# Altium project IMX93EVK-SOM.PrjPcb (part 4 of 6)

## Sheet C-12 PWR MEAS.SchDoc
size 817 x 513 mm; Address1: 350W 9th Ave; Address2: Suite 206; Address3: Escondido CA 92025; Address4: United States; Revision: -; ENG_APP_DATE: --/--/--; DSN_APP_DATE: --/--/--; CHK_APP_DATE: --/--/--
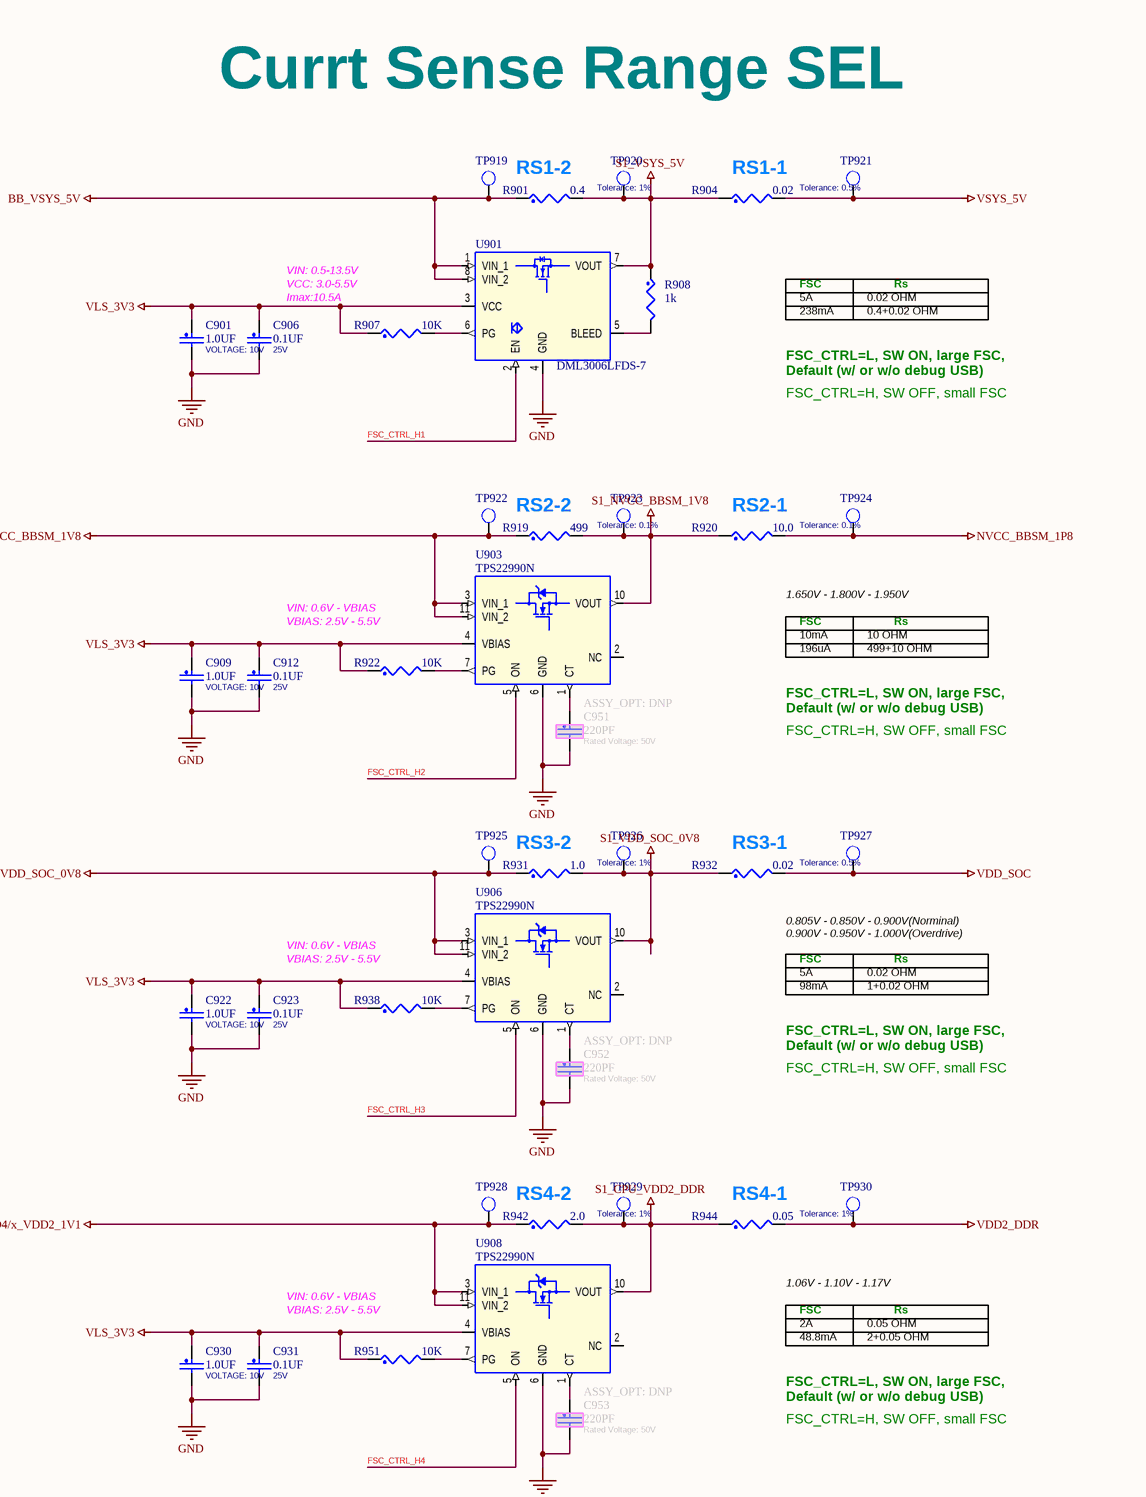
[diagram p22: C-12 PWR MEAS.SchDoc, top left]
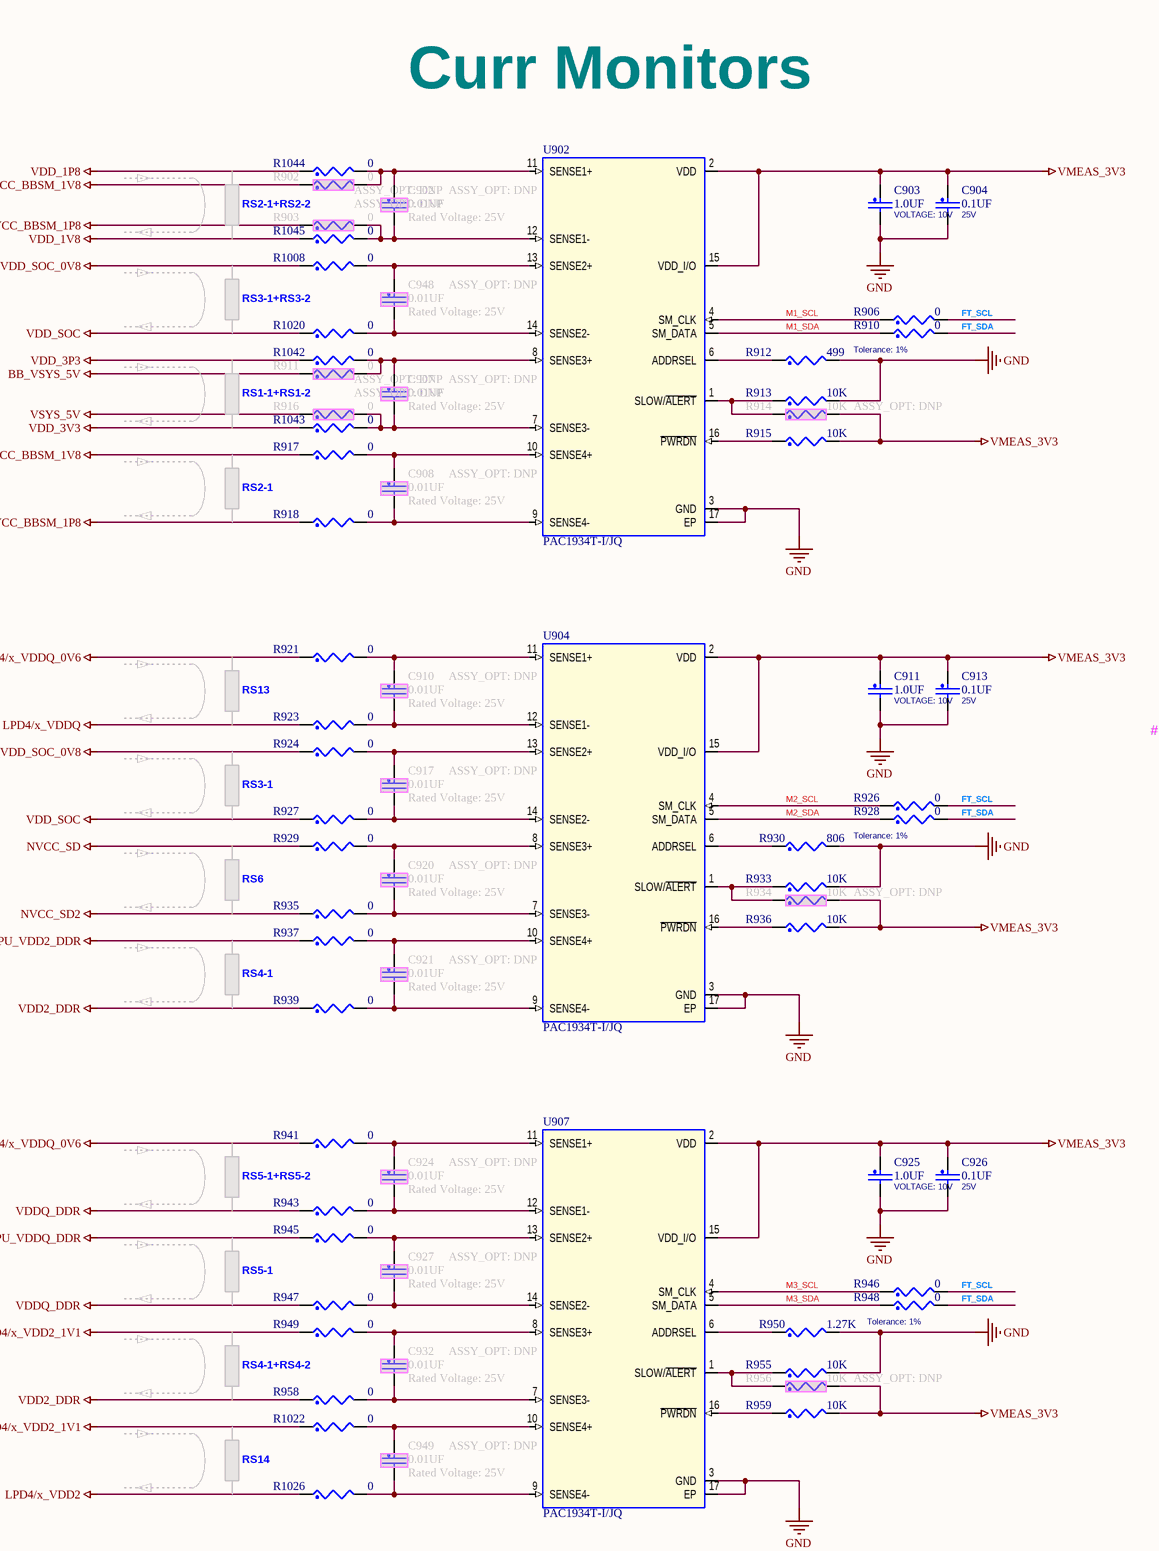
[diagram p23: C-12 PWR MEAS.SchDoc, top middle]
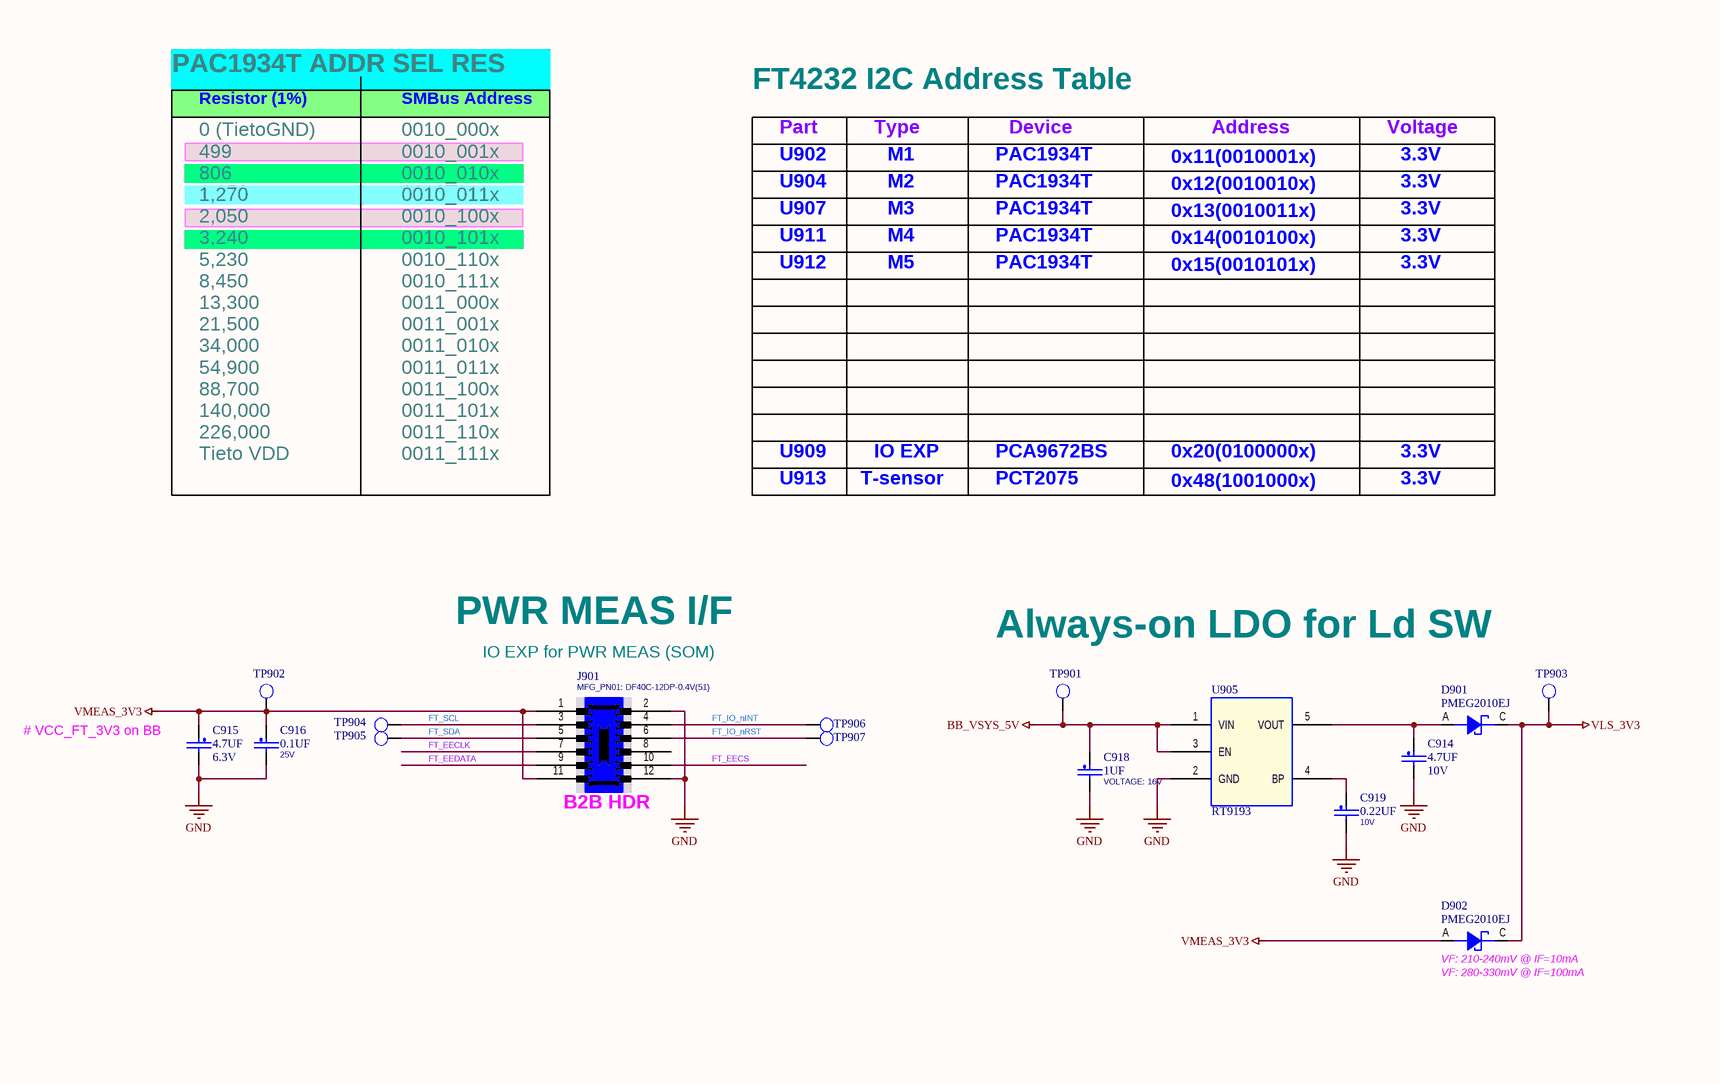
[diagram p24: C-12 PWR MEAS.SchDoc, top right]
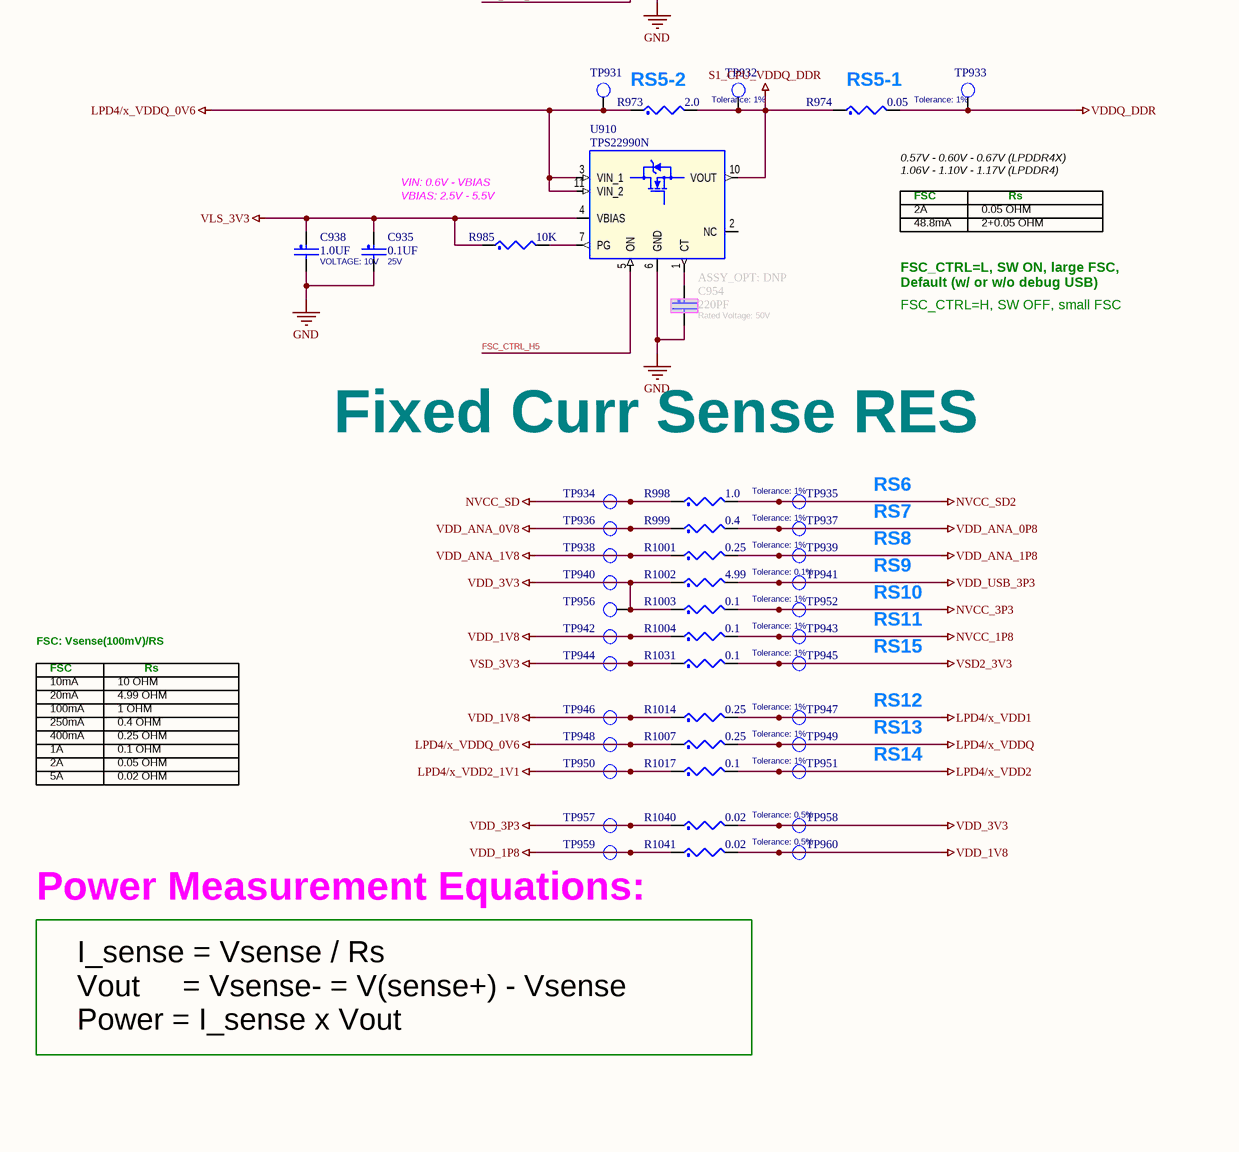
[diagram p25: C-12 PWR MEAS.SchDoc, bottom left]
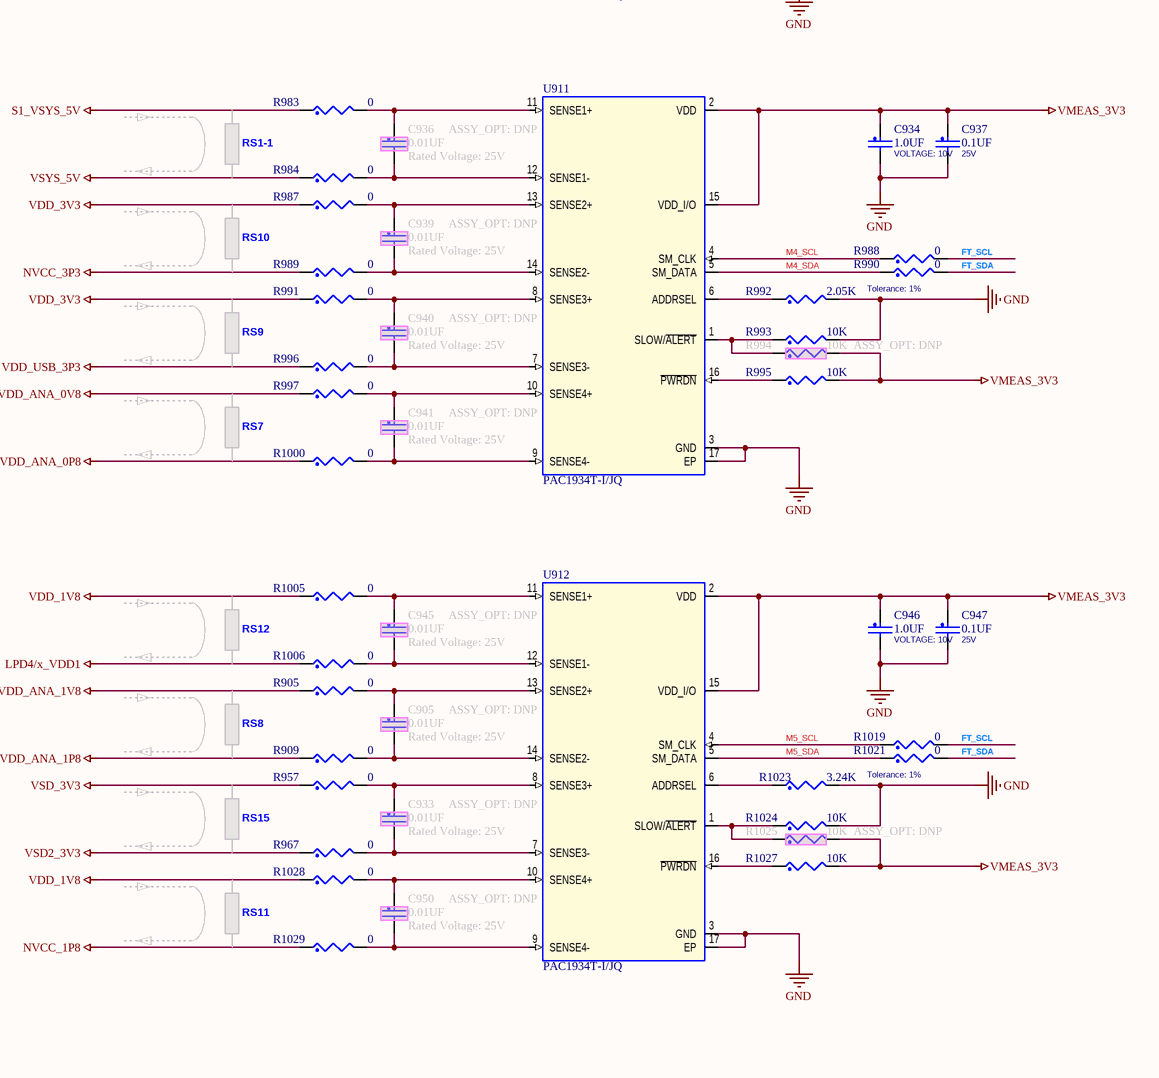
[diagram p26: C-12 PWR MEAS.SchDoc, bottom middle]
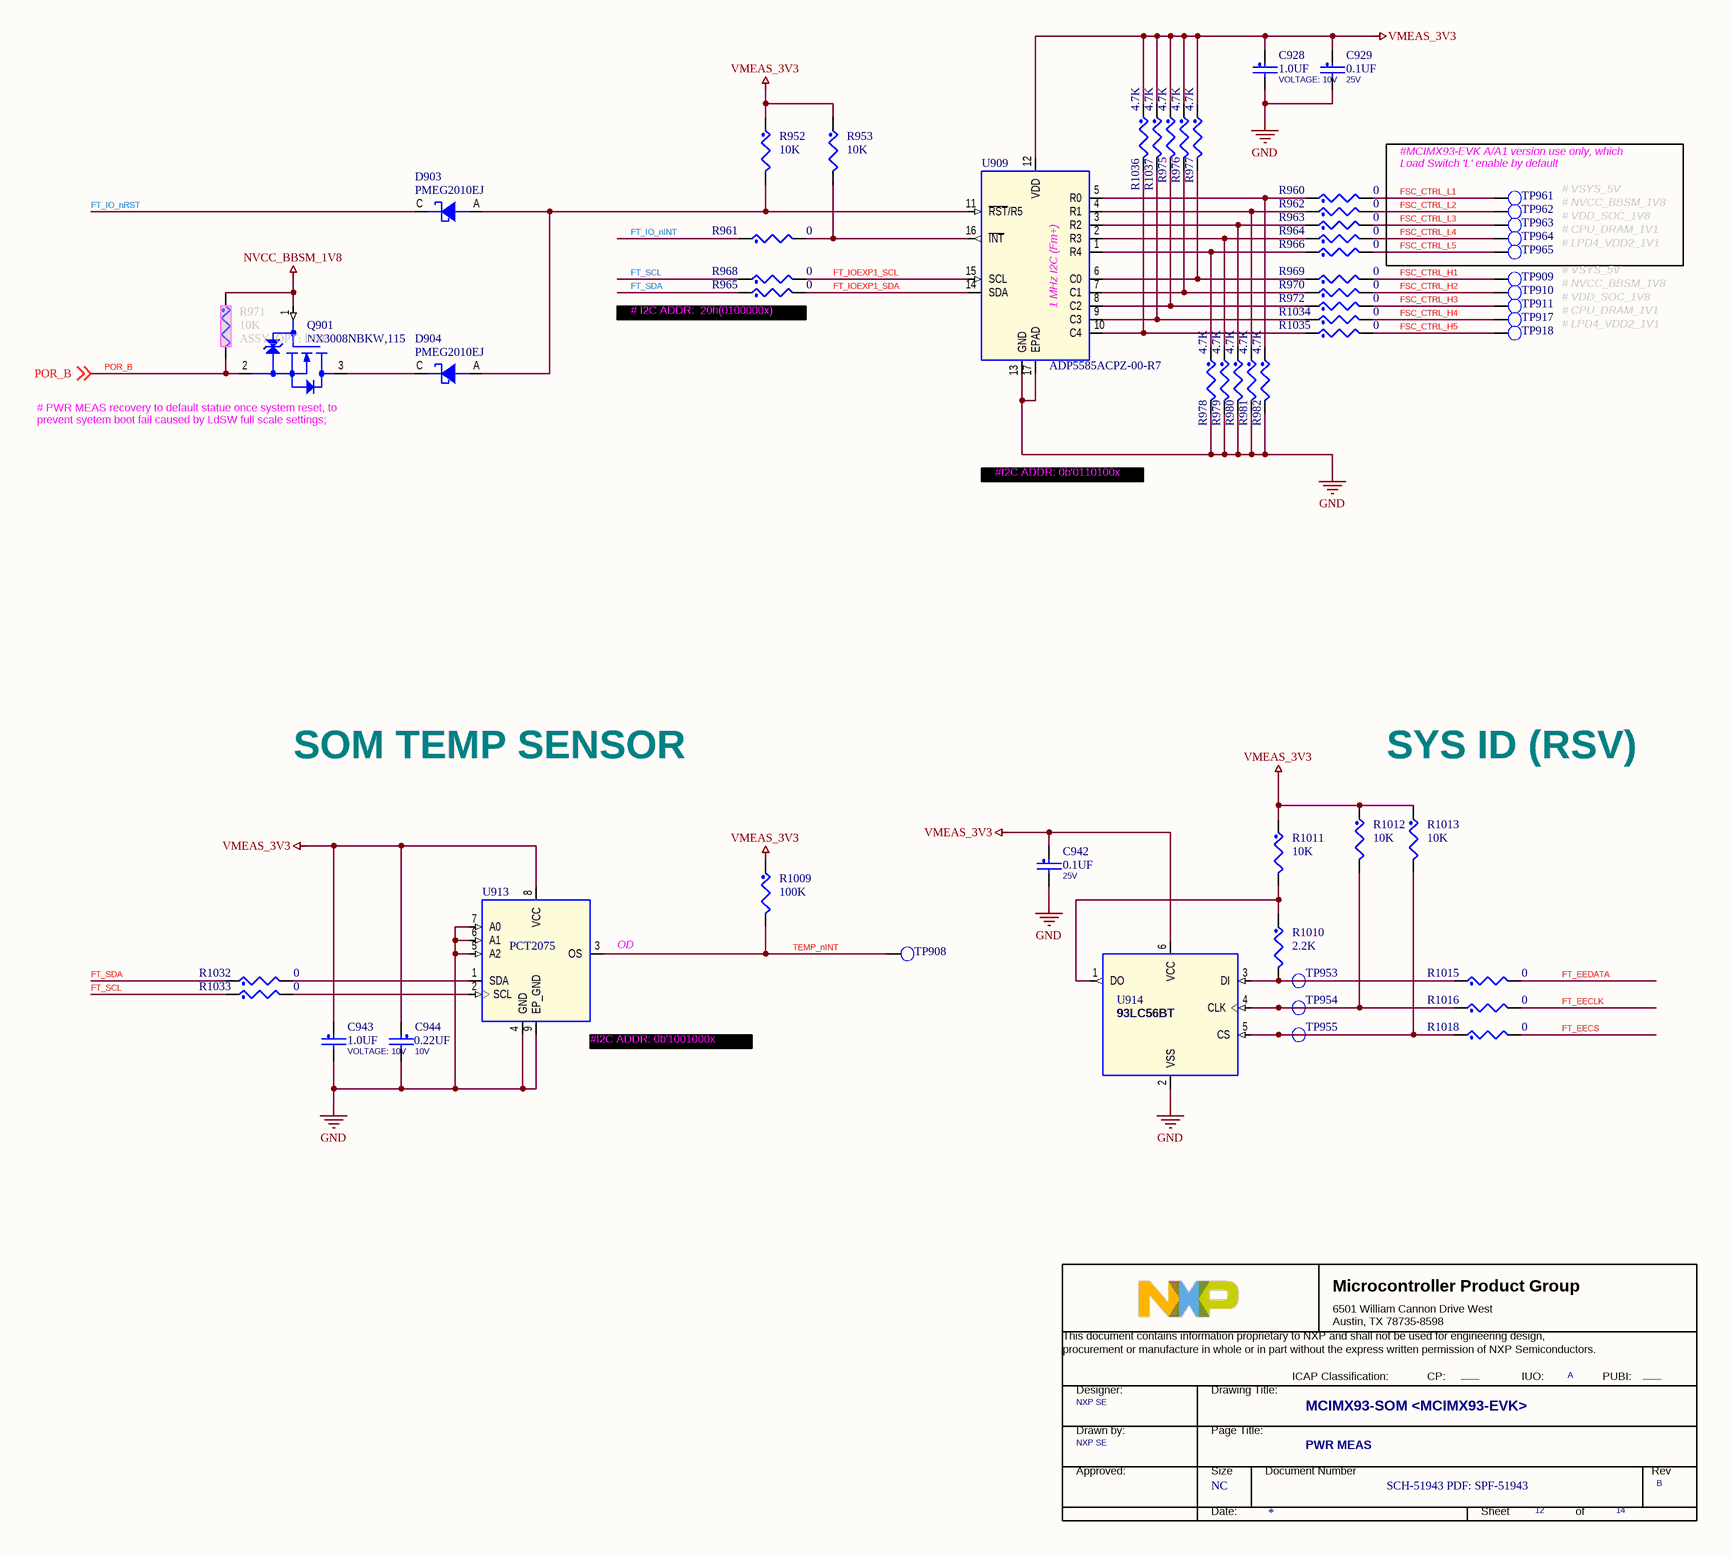
[diagram p27: C-12 PWR MEAS.SchDoc, bottom right]

### Parts
(Parts that share a designator on the sheet are numbered #1, #2 ... from top to bottom, then left to right.)
*#12  Doc: SCH-51943 PDF: SPF-51943  RevCode: B  Title: MCIMX93-SOM <MCIMX93-EVK>  Page Size: NC  Page Number: 12  Page Count: 14  PageTitle: PWR MEAS  Designer: NXP SE  PUBI: ____  FIUO: A  (hidden comment: TitleBlock_MCPG)  (graphical)
C901  1.0UF  VOLTAGE: 10V  [0402_CC]
C902  0.01UF  ASSY_OPT: DNP  Rated Voltage: 25V  [CC0402_25]
C903  1.0UF  VOLTAGE: 10V  [0402_CC]
C904  0.1UF  VOLTAGE: 25V  [0402_CC]
C905  0.01UF  ASSY_OPT: DNP  Rated Voltage: 25V  [CC0402_25]
C906  0.1UF  VOLTAGE: 25V  [0402_CC]
C907  0.01UF  ASSY_OPT: DNP  Rated Voltage: 25V  [CC0402_25]
C908  0.01UF  ASSY_OPT: DNP  Rated Voltage: 25V  [CC0402_25]
C909  1.0UF  VOLTAGE: 10V  [0402_CC]
C910  0.01UF  ASSY_OPT: DNP  Rated Voltage: 25V  [CC0402_25]
C911  1.0UF  VOLTAGE: 10V  [0402_CC]
C912  0.1UF  VOLTAGE: 25V  [0402_CC]
C913  0.1UF  VOLTAGE: 25V  [0402_CC]
C914  4.7UF  VOLTAGE: 10V  [cc0402_tol0p15]
C915  4.7UF  voltage rating: 6.3V  [cc0402_tol0p15]
C916  0.1UF  VOLTAGE: 25V  [0402_CC]
C917  0.01UF  ASSY_OPT: DNP  Rated Voltage: 25V  [CC0402_25]
C918  1UF  VOLTAGE: 16V  [0402_CC]
C919  0.22UF  VOLTAGE: 10V  [0201_CC]
C920  0.01UF  ASSY_OPT: DNP  Rated Voltage: 25V  [CC0402_25]
C921  0.01UF  ASSY_OPT: DNP  Rated Voltage: 25V  [CC0402_25]
C922  1.0UF  VOLTAGE: 10V  [0402_CC]
C923  0.1UF  VOLTAGE: 25V  [0402_CC]
C924  0.01UF  ASSY_OPT: DNP  Rated Voltage: 25V  [CC0402_25]
C925  1.0UF  VOLTAGE: 10V  [0402_CC]
C926  0.1UF  VOLTAGE: 25V  [0402_CC]
C927  0.01UF  ASSY_OPT: DNP  Rated Voltage: 25V  [CC0402_25]
C928  1.0UF  VOLTAGE: 10V  [0402_CC]
C929  0.1UF  VOLTAGE: 25V  [0402_CC]
C930  1.0UF  VOLTAGE: 10V  [0402_CC]
C931  0.1UF  VOLTAGE: 25V  [0402_CC]
C932  0.01UF  ASSY_OPT: DNP  Rated Voltage: 25V  [CC0402_25]
C933  0.01UF  ASSY_OPT: DNP  Rated Voltage: 25V  [CC0402_25]
C934  1.0UF  VOLTAGE: 10V  [0402_CC]
C935  0.1UF  VOLTAGE: 25V  [0402_CC]
C936  0.01UF  ASSY_OPT: DNP  Rated Voltage: 25V  [CC0402_25]
C937  0.1UF  VOLTAGE: 25V  [0402_CC]
C938  1.0UF  VOLTAGE: 10V  [0402_CC]
C939  0.01UF  ASSY_OPT: DNP  Rated Voltage: 25V  [CC0402_25]
C940  0.01UF  ASSY_OPT: DNP  Rated Voltage: 25V  [CC0402_25]
C941  0.01UF  ASSY_OPT: DNP  Rated Voltage: 25V  [CC0402_25]
C942  0.1UF  VOLTAGE: 25V  [0402_CC]
C943  1.0UF  VOLTAGE: 10V  [0402_CC]
C944  0.22UF  VOLTAGE: 10V  [0201_CC]
C945  0.01UF  ASSY_OPT: DNP  Rated Voltage: 25V  [CC0402_25]
C946  1.0UF  VOLTAGE: 10V  [0402_CC]
C947  0.1UF  VOLTAGE: 25V  [0402_CC]
C948  0.01UF  ASSY_OPT: DNP  Rated Voltage: 25V  [CC0402_25]
C949  0.01UF  ASSY_OPT: DNP  Rated Voltage: 25V  [CC0402_25]
C950  0.01UF  ASSY_OPT: DNP  Rated Voltage: 25V  [CC0402_25]
C951  220PF  ASSY_OPT: DNP  Rated Voltage: 50V  [0402_CC]
C952  220PF  ASSY_OPT: DNP  Rated Voltage: 50V  [0402_CC]
C953  220PF  ASSY_OPT: DNP  Rated Voltage: 50V  [0402_CC]
C954  220PF  ASSY_OPT: DNP  Rated Voltage: 50V  [0402_CC]
D901  PMEG2010EJ  [sod323]
D902  PMEG2010EJ  [sod323]
D903  PMEG2010EJ  [sod323]
D904  PMEG2010EJ  [sod323]
J901  MFG_PN01: DF40C-12DP-0.4V(51)  [con12_0p4_4p12x2p05_sm]  (hidden comment: CON 2X6)
Q901  NX3008NBKW,115  [sc70_3]
R901  0.4  Tolerance: 1%  [RC0603_OV]
R902  0  ASSY_OPT: DNP  [0402_CC]
R903  0  ASSY_OPT: DNP  [0402_CC]
R904  0.02  Tolerance: 0.5%  [RC0805_OV]
R905  0  [0402_CC]
R906  0  [0201_CC]
R907  10K  [0402_CC]
R908  1k  [RC0603_OV]
R909  0  [0402_CC]
R910  0  [0201_CC]
R911  0  ASSY_OPT: DNP  [0402_CC]
R912  499  Tolerance: 1%  [RC0402_25]
R913  10K  [0402_CC]
R914  10K  ASSY_OPT: DNP  [0402_CC]
R915  10K  [0402_CC]
R916  0  ASSY_OPT: DNP  [0402_CC]
R917  0  [0402_CC]
R918  0  [0402_CC]
R919  499  Tolerance: 0.1%  [RC0603_OV]
R920  10.0  Tolerance: 0.1%  [RC0603_OV]
R921  0  [0402_CC]
R922  10K  [0402_CC]
R923  0  [0402_CC]
R924  0  [0402_CC]
R926  0  [0201_CC]
R927  0  [0402_CC]
R928  0  [0201_CC]
R929  0  [0402_CC]
R930  806  Tolerance: 1%  [RC0402_25]
R931  1.0  Tolerance: 1%  [RC0603_OV]
R932  0.02  Tolerance: 0.5%  [RC0805_OV]
R933  10K  [0402_CC]
R934  10K  ASSY_OPT: DNP  [0402_CC]
R935  0  [0402_CC]
R936  10K  [0402_CC]
R937  0  [0402_CC]
R938  10K  [0402_CC]
R939  0  [0402_CC]
R941  0  [0402_CC]
R942  2.0  Tolerance: 1%  [RC0603_OV]
R943  0  [0402_CC]
R944  0.05  Tolerance: 1%  [RC0805_OV]
R945  0  [0402_CC]
R946  0  [0201_CC]
R947  0  [0402_CC]
R948  0  [0201_CC]
R949  0  [0402_CC]
R950  1.27K  Tolerance: 1%  [RC0402_25]
R951  10K  [0402_CC]
R952  10K  [0402_CC]
R953  10K  [0402_CC]
R955  10K  [0402_CC]
R956  10K  ASSY_OPT: DNP  [0402_CC]
R957  0  [0402_CC]
R958  0  [0402_CC]
R959  10K  [0402_CC]
R960  0  [0402_CC]
R961  0  [0402_CC]
R962  0  [0402_CC]
R963  0  [0402_CC]
R964  0  [0402_CC]
R965  0  [0402_CC]
R966  0  [0402_CC]
R967  0  [0402_CC]
R968  0  [0402_CC]
R969  0  [0402_CC]
R970  0  [0402_CC]
R971  10K  ASSY_OPT: DNP  [0402_CC]
R972  0  [0402_CC]
R973  2.0  Tolerance: 1%  [RC0603_OV]
R974  0.05  Tolerance: 1%  [RC0805_OV]
R975  4.7K  [0402_CC]
R976  4.7K  [0402_CC]
R977  4.7K  [0402_CC]
R978  4.7K  [0402_CC]
R979  4.7K  [0402_CC]
R980  4.7K  [0402_CC]
R981  4.7K  [0402_CC]
R982  4.7K  [0402_CC]
R983  0  [0402_CC]
R984  0  [0402_CC]
R985  10K  [0402_CC]
R987  0  [0402_CC]
R988  0  [0201_CC]
R989  0  [0402_CC]
R990  0  [0201_CC]
R991  0  [0402_CC]
R992  2.05K  Tolerance: 1%  [RC0402_25]
R993  10K  [0402_CC]
R994  10K  ASSY_OPT: DNP  [0402_CC]
R995  10K  [0402_CC]
R996  0  [0402_CC]
R997  0  [0402_CC]
R998  1.0  Tolerance: 1%  [RC0603_OV]
R999  0.4  Tolerance: 1%  [RC0603_OV]
R1000  0  [0402_CC]
R1001  0.25  Tolerance: 1%  [RC0805_OV]
R1002  4.99  Tolerance: 0.1%  [RC0603_OV]
R1003  0.1  Tolerance: 1%  [RC0805_OV]
R1004  0.1  Tolerance: 1%  [RC0805_OV]
R1005  0  [0402_CC]
R1006  0  [0402_CC]
R1007  0.25  Tolerance: 1%  [RC0805_OV]
R1008  0  [0402_CC]
R1009  100K  [0402_CC]
R1010  2.2K  [RC0402_25]
R1011  10K  [0402_CC]
R1012  10K  [0402_CC]
R1013  10K  [0402_CC]
R1014  0.25  Tolerance: 1%  [RC0805_OV]
R1015  0  [0402_CC]
R1016  0  [0402_CC]
R1017  0.1  Tolerance: 1%  [RC0805_OV]
R1018  0  [0402_CC]
R1019  0  [0201_CC]
R1020  0  [0402_CC]
R1021  0  [0201_CC]
R1022  0  [0402_CC]
R1023  3.24K  Tolerance: 1%  [RC0402_25]
R1024  10K  [0402_CC]
R1025  10K  ASSY_OPT: DNP  [0402_CC]
R1026  0  [0402_CC]
R1027  10K  [0402_CC]
R1028  0  [0402_CC]
R1029  0  [0402_CC]
R1031  0.1  Tolerance: 1%  [RC0805_OV]
R1032  0  [0402_CC]
R1033  0  [0402_CC]
R1034  0  [0402_CC]
R1035  0  [0402_CC]
R1036  4.7K  [0402_CC]
R1037  4.7K  [0402_CC]
R1040  0.02  Tolerance: 0.5%  [RC0805_OV]
R1041  0.02  Tolerance: 0.5%  [RC0805_OV]
R1042  0  [0402_CC]
R1043  0  [0402_CC]
R1044  0  [0402_CC]
R1045  0  [0402_CC]
TP901  TP_35MIL  [testpoint_35mil]  (value not drawn)  (no BOM)
TP902  TP_35MIL  [testpoint_35mil]  (value not drawn)  (no BOM)
TP903  TP_35MIL  [testpoint_35mil]  (value not drawn)  (no BOM)
TP904  TP_35MIL  [testpoint_35mil]  (value not drawn)  (no BOM)
TP905  TP_35MIL  [testpoint_35mil]  (value not drawn)  (no BOM)
TP906  TP_35MIL  [testpoint_35mil]  (value not drawn)  (no BOM)
TP907  TP_35MIL  [testpoint_35mil]  (value not drawn)  (no BOM)
TP908  TP_35MIL  [testpoint_35mil]  (value not drawn)  (no BOM)
TP909  TP_35MIL  [testpoint_35mil]  (value not drawn)  (no BOM)
TP910  TP_35MIL  [testpoint_35mil]  (value not drawn)  (no BOM)
TP911  TP_35MIL  [testpoint_35mil]  (value not drawn)  (no BOM)
TP917  TP_35MIL  [testpoint_35mil]  (value not drawn)  (no BOM)
TP918  TP_35MIL  [testpoint_35mil]  (value not drawn)  (no BOM)
TP919  TP_35MIL  [testpoint_35mil]  (value not drawn)  (no BOM)
TP920  TP_35MIL  [testpoint_35mil]  (value not drawn)  (no BOM)
TP921  TP_35MIL  [testpoint_35mil]  (value not drawn)  (no BOM)
TP922  TP_35MIL  [testpoint_35mil]  (value not drawn)  (no BOM)
TP923  TP_35MIL  [testpoint_35mil]  (value not drawn)  (no BOM)
TP924  TP_35MIL  [testpoint_35mil]  (value not drawn)  (no BOM)
TP925  TP_35MIL  [testpoint_35mil]  (value not drawn)  (no BOM)
TP926  TP_35MIL  [testpoint_35mil]  (value not drawn)  (no BOM)
TP927  TP_35MIL  [testpoint_35mil]  (value not drawn)  (no BOM)
TP928  TP_35MIL  [testpoint_35mil]  (value not drawn)  (no BOM)
TP929  TP_35MIL  [testpoint_35mil]  (value not drawn)  (no BOM)
TP930  TP_35MIL  [testpoint_35mil]  (value not drawn)  (no BOM)
TP931  TP_35MIL  [testpoint_35mil]  (value not drawn)  (no BOM)
TP932  TP_35MIL  [testpoint_35mil]  (value not drawn)  (no BOM)
TP933  TP_35MIL  [testpoint_35mil]  (value not drawn)  (no BOM)
TP934  TP_35MIL  [testpoint_35mil]  (value not drawn)  (no BOM)
TP935  TP_35MIL  [testpoint_35mil]  (value not drawn)  (no BOM)
TP936  TP_35MIL  [testpoint_35mil]  (value not drawn)  (no BOM)
TP937  TP_35MIL  [testpoint_35mil]  (value not drawn)  (no BOM)
TP938  TP_35MIL  [testpoint_35mil]  (value not drawn)  (no BOM)
TP939  TP_35MIL  [testpoint_35mil]  (value not drawn)  (no BOM)
TP940  TP_35MIL  [testpoint_35mil]  (value not drawn)  (no BOM)
TP941  TP_35MIL  [testpoint_35mil]  (value not drawn)  (no BOM)
TP942  TP_35MIL  [testpoint_35mil]  (value not drawn)  (no BOM)
TP943  TP_35MIL  [testpoint_35mil]  (value not drawn)  (no BOM)
TP944  TP_35MIL  [testpoint_35mil]  (value not drawn)  (no BOM)
TP945  TP_35MIL  [testpoint_35mil]  (value not drawn)  (no BOM)
TP946  TP_35MIL  [testpoint_35mil]  (value not drawn)  (no BOM)
TP947  TP_35MIL  [testpoint_35mil]  (value not drawn)  (no BOM)
TP948  TP_35MIL  [testpoint_35mil]  (value not drawn)  (no BOM)
TP949  TP_35MIL  [testpoint_35mil]  (value not drawn)  (no BOM)
TP950  TP_35MIL  [testpoint_35mil]  (value not drawn)  (no BOM)
TP951  TP_35MIL  [testpoint_35mil]  (value not drawn)  (no BOM)
TP952  TP_35MIL  [testpoint_35mil]  (value not drawn)  (no BOM)
TP953  TP_35MIL  [testpoint_35mil]  (value not drawn)  (no BOM)
TP954  TP_35MIL  [testpoint_35mil]  (value not drawn)  (no BOM)
TP955  TP_35MIL  [testpoint_35mil]  (value not drawn)  (no BOM)
TP956  TP_35MIL  [testpoint_35mil]  (value not drawn)  (no BOM)
TP957  TP_35MIL  [testpoint_35mil]  (value not drawn)  (no BOM)
TP958  TP_35MIL  [testpoint_35mil]  (value not drawn)  (no BOM)
TP959  TP_35MIL  [testpoint_35mil]  (value not drawn)  (no BOM)
TP960  TP_35MIL  [testpoint_35mil]  (value not drawn)  (no BOM)
TP961  TP_35MIL  [testpoint_35mil]  (value not drawn)  (no BOM)
TP962  TP_35MIL  [testpoint_35mil]  (value not drawn)  (no BOM)
TP963  TP_35MIL  [testpoint_35mil]  (value not drawn)  (no BOM)
TP964  TP_35MIL  [testpoint_35mil]  (value not drawn)  (no BOM)
TP965  TP_35MIL  [testpoint_35mil]  (value not drawn)  (no BOM)
U901  DML3006LFDS-7  [dfn2020_0p5_sq2]
U902  PAC1934T-I/JQ  [qfn16_0p65_4X4_a]
U903  TPS22990N  [wson10_0p5_2p1x3p1]
U904  PAC1934T-I/JQ  [qfn16_0p65_4X4_a]
U905  RT9193  [sot23-5]
U906  TPS22990N  [wson10_0p5_2p1x3p1]
U907  PAC1934T-I/JQ  [qfn16_0p65_4X4_a]
U908  TPS22990N  [wson10_0p5_2p1x3p1]
U909  ADP5585ACPZ-00-R7  [lfcsp_16_0p5_3x3_a]
U910  TPS22990N  [wson10_0p5_2p1x3p1]
U911  PAC1934T-I/JQ  [qfn16_0p65_4X4_a]
U912  PAC1934T-I/JQ  [qfn16_0p65_4X4_a]
U913  PCT2075  [hwson8_0p5_3p1x2p1]
U914  93LC56BT  [sot23-6]

### Nets
BB_VSYS_5V: C918.1 R901.1 R911.1 TP901.1(TP) TP919.1(TP) U901.1(VIN_1) U901.8(VIN_2) U905.1(VIN) U905.3(EN)
GND: C901.2 C903.2 C904.2 C906.2 C909.2 C911.2 C912.2 C913.2 C914.2 C915.2 C916.2 C918.2 C919.2 C922.2 C923.2 C925.2 C926.2 C928.2 C929.2 C930.2 C931.2 C934.2 C935.2 C937.2 C938.2 C942.2 C943.2 C944.2 C946.2 C947.2 C951.2 C952.2 C953.2 C954.2 J901.2(B1) J901.12(B6) R912.2 R913.2 R930.2 R933.2 R950.2 R955.2 R978.2 R979.2 R980.2 R981.2 R982.2 R992.2 R993.2 R1023.2 R1024.2 U901.4(GND) U902.3(GND) U902.17(EP) U903.6(GND) U904.3(GND) U904.17(EP) U905.2(GND) U906.6(GND) U907.3(GND) U907.17(EP) U908.6(GND) U909.13(GND) U909.17(EPAD) U910.6(GND) U911.3(GND) U911.17(EP) U912.3(GND) U912.17(EP) U913.4(GND) U913.5(A2) U913.6(A1) U913.7(A0) U913.9(EP_GND) U914.2(VSS)
LPD4/x_VDD1: R1006.1 R1014.2 TP947.1(TP)
LPD4/x_VDD2: R1017.2 R1026.1 TP951.1(TP)
LPD4/x_VDD2_1V1: R942.1 R949.1 R1017.1 R1022.1 TP928.1(TP) TP950.1(TP) U908.3(VIN_1) U908.11(VIN_2)
LPD4/x_VDDQ: R923.1 R1007.2 TP949.1(TP)
LPD4/x_VDDQ_0V6: R921.1 R941.1 R973.1 R1007.1 TP931.1(TP) TP948.1(TP) U910.3(VIN_1) U910.11(VIN_2)
NVCC_1P8: R1004.2 R1029.1 TP943.1(TP)
NVCC_3P3: R989.1 R1003.2 TP952.1(TP)
NVCC_BBSM_1P8: R903.1 R918.1 R920.2 TP924.1(TP)
NVCC_BBSM_1V8: Q901.1(GATE) R902.1 R919.1 R971.1 TP922.1(TP) U903.3(VIN_1) U903.11(VIN_2)
NVCC_SD: R929.1 R998.1 TP934.1(TP)
NVCC_SD2: R935.1 R998.2 TP935.1(TP)
S1_CPU_VDD2_DDR: R937.1 R942.2 R944.1 TP929.1(TP) U908.10(VOUT)
S1_CPU_VDDQ_DDR: R945.1 R973.2 R974.1 TP932.1(TP) U910.10(VOUT)
S1_NVCC_BBSM_1V8: R917.1 R919.2 R920.1 TP923.1(TP) U903.10(VOUT)
S1_VDD_SOC_0V8: R924.1 R931.2 R932.1 TP926.1(TP) U906.10(VOUT)
S1_VSYS_5V: R901.2 R904.1 R908.1 R983.1 TP920.1(TP) U901.7(VOUT)
VDD2_DDR: R939.1 R944.2 R958.1 TP930.1(TP)
VDD_1P8: R1041.1 R1044.1 TP959.1(TP)
VDD_1V8: R1004.1 R1005.1 R1014.1 R1028.1 R1041.2 R1045.1 TP942.1(TP) TP946.1(TP) TP960.1(TP)
VDD_3P3: R1040.1 R1042.1 TP957.1(TP)
VDD_3V3: R987.1 R991.1 R1002.1 R1003.1 R1040.2 R1043.1 TP940.1(TP) TP956.1(TP) TP958.1(TP)
VDD_ANA_0P8: R999.2 R1000.1 TP937.1(TP)
VDD_ANA_0V8: R997.1 R999.1 TP936.1(TP)
VDD_ANA_1P8: R909.1 R1001.2 TP939.1(TP)
VDD_ANA_1V8: R905.1 R1001.1 TP938.1(TP)
VDD_SOC: R927.1 R932.2 R1020.1 TP927.1(TP)
VDD_SOC_0V8: R931.1 R1008.1 TP925.1(TP) U906.3(VIN_1) U906.11(VIN_2)
VDD_USB_3P3: R996.1 R1002.2 TP941.1(TP)
VDDQ_DDR: R943.1 R947.1 R974.2 TP933.1(TP)
VLS_3V3: C901.1 C906.1 C909.1 C912.1 C922.1 C923.1 C930.1 C931.1 C935.1 C938.1 D901.C D902.C R907.1 R922.1 R938.1 R951.1 R985.1 TP903.1(TP) U901.3(VCC) U903.4(VBIAS) U906.4(VBIAS) U908.4(VBIAS) U910.4(VBIAS)
VMEAS_3V3: C903.1 C904.1 C911.1 C913.1 C915.1 C916.1 C925.1 C926.1 C928.1 C929.1 C934.1 C937.1 C942.1 C943.1 C944.1 C946.1 C947.1 D902.A J901.1(A1) J901.11(A6) R914.2 R915.2 R934.2 R936.2 R952.1 R953.1 R956.2 R959.2 R975.1 R976.1 R977.1 R994.2 R995.2 R1009.1 R1011.1 R1012.1 R1013.1 R1025.2 R1027.2 R1036.1 R1037.1 TP902.1(TP) U902.2(VDD) U902.15(VDD_I/O) U904.2(VDD) U904.15(VDD_I/O) U907.2(VDD) U907.15(VDD_I/O) U909.12(VDD) U911.2(VDD) U911.15(VDD_I/O) U912.2(VDD) U912.15(VDD_I/O) U913.8(VCC) U914.6(VCC)
VSD2_3V3: R967.1 R1031.2 TP945.1(TP)
VSD_3V3: R957.1 R1031.1 TP944.1(TP)
VSYS_5V: R904.2 R916.1 R984.1 TP921.1(TP)
FSC_CTRL_H1: R969.2 TP909.1(TP) U901.2(EN)
FSC_CTRL_H2: R970.2 TP910.1(TP) U903.5(ON)
FSC_CTRL_H3: R972.2 TP911.1(TP) U906.5(ON)
FSC_CTRL_H4: R1034.2 TP917.1(TP) U908.5(ON)
FSC_CTRL_H5: R1035.2 TP918.1(TP) U910.5(ON)
FSC_CTRL_L1: R960.2 TP961.1(TP)
FSC_CTRL_L2: R962.2 TP962.1(TP)
FSC_CTRL_L3: R963.2 TP963.1(TP)
FSC_CTRL_L4: R964.2 TP964.1(TP)
FSC_CTRL_L5: R966.2 TP965.1(TP)
FT_EECLK: J901.7(A4) R1016.2
FT_EECS: J901.10(B5) R1018.2
FT_EEDATA: J901.9(A5) R1015.2
FT_IO_nINT: J901.4(B2) R961.1 TP906.1(TP)
FT_IO_nRST: D903.C J901.6(B3) TP907.1(TP)
FT_IOEXP1_SCL: R968.2 U909.15(SCL)
FT_IOEXP1_SDA: R965.2 U909.14(SDA)
FT_SCL: J901.3(A2) R906.2 R926.2 R946.2 R968.1 R988.2 R1019.2 R1033.1 TP904.1(TP)
FT_SDA: J901.5(A3) R910.2 R928.2 R948.2 R965.1 R990.2 R1021.2 R1032.1 TP905.1(TP)
M1_SCL: R906.1 U902.4(SM_CLK)
M1_SDA: R910.1 U902.5(SM_DATA)
M2_SCL: R926.1 U904.4(SM_CLK)
M2_SDA: R928.1 U904.5(SM_DATA)
M3_SCL: R946.1 U907.4(SM_CLK)
M3_SDA: R948.1 U907.5(SM_DATA)
M4_SCL: R988.1 U911.4(SM_CLK)
M4_SDA: R990.1 U911.5(SM_DATA)
M5_SCL: R1019.1 U912.4(SM_CLK)
M5_SDA: R1021.1 U912.5(SM_DATA)
POR_B: Q901.2(SOURCE) R971.2 ; off-sheet POR_B
TEMP_nINT: R1009.2 TP908.1(TP) U913.3(OS)
NetC902_1: C902.1 R902.2 R1044.2 U902.11(SENSE1+)
NetC902_2: C902.2 R903.2 R1045.2 U902.12(SENSE1-)
NetC905_1: C905.1 R905.2 U912.13(SENSE2+)
NetC905_2: C905.2 R909.2 U912.14(SENSE2-)
NetC907_1: C907.1 R911.2 R1042.2 U902.8(SENSE3+)
NetC907_2: C907.2 R916.2 R1043.2 U902.7(SENSE3-)
NetC908_1: C908.1 R917.2 U902.10(SENSE4+)
NetC908_2: C908.2 R918.2 U902.9(SENSE4-)
NetC910_1: C910.1 R921.2 U904.11(SENSE1+)
NetC910_2: C910.2 R923.2 U904.12(SENSE1-)
NetC914_1: C914.1 D901.A U905.5(VOUT)
NetC917_1: C917.1 R924.2 U904.13(SENSE2+)
NetC917_2: C917.2 R927.2 U904.14(SENSE2-)
NetC919_1: C919.1 U905.4(BP)
NetC920_1: C920.1 R929.2 U904.8(SENSE3+)
NetC920_2: C920.2 R935.2 U904.7(SENSE3-)
NetC921_1: C921.1 R937.2 U904.10(SENSE4+)
NetC921_2: C921.2 R939.2 U904.9(SENSE4-)
NetC924_1: C924.1 R941.2 U907.11(SENSE1+)
NetC924_2: C924.2 R943.2 U907.12(SENSE1-)
NetC927_1: C927.1 R945.2 U907.13(SENSE2+)
NetC927_2: C927.2 R947.2 U907.14(SENSE2-)
NetC932_1: C932.1 R949.2 U907.8(SENSE3+)
NetC932_2: C932.2 R958.2 U907.7(SENSE3-)
NetC933_1: C933.1 R957.2 U912.8(SENSE3+)
NetC933_2: C933.2 R967.2 U912.7(SENSE3-)
NetC936_1: C936.1 R983.2 U911.11(SENSE1+)
NetC936_2: C936.2 R984.2 U911.12(SENSE1-)
NetC939_1: C939.1 R987.2 U911.13(SENSE2+)
NetC939_2: C939.2 R989.2 U911.14(SENSE2-)
NetC940_1: C940.1 R991.2 U911.8(SENSE3+)
NetC940_2: C940.2 R996.2 U911.7(SENSE3-)
NetC941_1: C941.1 R997.2 U911.10(SENSE4+)
NetC941_2: C941.2 R1000.2 U911.9(SENSE4-)
NetC945_1: C945.1 R1005.2 U912.11(SENSE1+)
NetC945_2: C945.2 R1006.2 U912.12(SENSE1-)
NetC948_1: C948.1 R1008.2 U902.13(SENSE2+)
NetC948_2: C948.2 R1020.2 U902.14(SENSE2-)
NetC949_1: C949.1 R1022.2 U907.10(SENSE4+)
NetC949_2: C949.2 R1026.2 U907.9(SENSE4-)
NetC950_1: C950.1 R1028.2 U912.10(SENSE4+)
NetC950_2: C950.2 R1029.2 U912.9(SENSE4-)
NetC951_1: C951.1 U903.1(CT)
NetC952_1: C952.1 U906.1(CT)
NetC953_1: C953.1 U908.1(CT)
NetC954_1: C954.1 U910.1(CT)
NetD903_A: D903.A D904.A R952.2 U909.11(~{RST}/R5)
NetD904_C: D904.C Q901.3(DRAIN)
NetR907_2: R907.2 U901.6(PG)
NetR908_2: R908.2 U901.5(BLEED)
NetR912_1: R912.1 U902.6(ADDRSEL)
NetR913_1: R913.1 R914.1 U902.1(SLOW/~{ALERT})
NetR915_1: R915.1 U902.16(~{PWRDN})
NetR922_2: R922.2 U903.7(PG)
NetR930_1: R930.1 U904.6(ADDRSEL)
NetR933_1: R933.1 R934.1 U904.1(SLOW/~{ALERT})
NetR936_1: R936.1 U904.16(~{PWRDN})
NetR938_2: R938.2 U906.7(PG)
NetR950_1: R950.1 U907.6(ADDRSEL)
NetR951_2: R951.2 U908.7(PG)
NetR953_2: R953.2 R961.2 U909.16(~{INT})
NetR955_1: R955.1 R956.1 U907.1(SLOW/~{ALERT})
NetR959_1: R959.1 U907.16(~{PWRDN})
NetR960_1: R960.1 R982.1 U909.5(R0)
NetR962_1: R962.1 R981.1 U909.4(R1)
NetR963_1: R963.1 R980.1 U909.3(R2)
NetR964_1: R964.1 R979.1 U909.2(R3)
NetR966_1: R966.1 R978.1 U909.1(R4)
NetR969_1: R969.1 R977.2 U909.6(C0)
NetR970_1: R970.1 R976.2 U909.7(C1)
NetR972_1: R972.1 R975.2 U909.8(C2)
NetR985_2: R985.2 U910.7(PG)
NetR992_1: R992.1 U911.6(ADDRSEL)
NetR993_1: R993.1 R994.1 U911.1(SLOW/~{ALERT})
NetR995_1: R995.1 U911.16(~{PWRDN})
NetR1010_1: R1010.1 R1011.2 U914.1(DO)
NetR1010_2: R1010.2 R1015.1 TP953.1(TP) U914.3(DI)
NetR1012_2: R1012.2 R1016.1 TP954.1(TP) U914.4(CLK)
NetR1013_2: R1013.2 R1018.1 TP955.1(TP) U914.5(CS)
NetR1023_1: R1023.1 U912.6(ADDRSEL)
NetR1024_1: R1024.1 R1025.1 U912.1(SLOW/~{ALERT})
NetR1027_1: R1027.1 U912.16(~{PWRDN})
NetR1032_2: R1032.2 U913.1(SDA)
NetR1033_2: R1033.2 U913.2(SCL)
NetR1034_1: R1034.1 R1037.2 U909.9(C3)
NetR1035_1: R1035.1 R1036.2 U909.10(C4)

Not connected (* = marked no-connect by the designer): J901 8(B4); U903 2(NC); U906 2(NC); U908 2(NC); U910 2(NC)

### Notes on the sheet
- Currt Sense Range SEL
- Curr Monitors
- PAC1934T ADDR SEL RES
- Resistor (1%)
- SMBus Address
- FT4232 I2C Address Table
- RS1-2
- (near R904) RS1-1
- Part
- U902
- U904
- Type
- M2
- M1
- PAC1934T
- Device
- 0x12(0010010x)
- 0x11(0010001x)
- Address
- Voltage
- 3.3V
- RS2-1+RS2-2
- U907
- U911
- M3
- M4
- 0x14(0010100x)
- 0x13(0010011x)
- Imax:10.5A
- VCC: 3.0-5.5V
- VIN: 0.5-13.5V
- 238mA
- FSC
- 5A
- 0.02 OHM
- 0.4+0.02 OHM
- Rs
- RS3-1+RS3-2
- U912
- M5
- 0x15(0010101x)
- FSC_CTRL=L, SW ON, large FSC,
  Default (w/ or w/o debug USB)
- FSC_CTRL=H, SW OFF, small FSC
- RS1-1+RS1-2
- U909
- IO EXP
- PCA9672BS
- 0x20(0100000x)
- RS2-2
- (near R920) RS2-1
- RS2-1
- 0 (TietoGND)
  499
  806
  1,270
  2,050
  3,240
  5,230
  8,450
  13,300
  21,500
  34,000
  54,900
  88,700
  140,000
  226,000
  Tieto VDD
- 0010_000x
  0010_001x
  0010_010x
  0010_011x
  0010_100x
  0010_101x
  0010_110x
  0010_111x
  0011_000x
  0011_001x
  0011_010x
  0011_011x
  0011_100x
  0011_101x
  0011_110x
  0011_111x
- U913
- T-sensor
- PCT2075
- 0x48(1001000x)
- 1.650V - 1.800V - 1.950V
- VBIAS: 2.5V - 5.5V
- VIN: 0.6V - VBIAS
- 10mA
- 196uA
- 499+10 OHM
- 10 OHM
- PWR MEAS I/F
- (near J901) IO EXP for PWR MEAS (SOM)
- Always-on LDO for Ld SW
- RS13
- # VCC_FT_3V3 on BB
- RS3-1
- RS3-2
- (near R932) RS3-1
- (near J901) B2B HDR
- 0.805V - 0.850V - 0.900V(Norminal)
  0.900V - 0.950V - 1.000V(Overdrive)
- RS6
- 98mA
- 1+0.02 OHM
- RS4-1
- (near D902) VF: 210-240mV @ IF=10mA
- (near D902) VF: 280-330mV @ IF=100mA
- RS4-2
- (near R944) RS4-1
- RS5-1+RS5-2
- RS5-1
- 1.06V - 1.10V - 1.17V
- 2A
- 48.8mA
- 2+0.05 OHM
- 0.05 OHM
- RS4-1+RS4-2
- #MCIMX93-EVK A/A1 version use only, which
  Load Switch 'L' enable by default
- # VSYS_5V
- # NVCC_BBSM_1V8
- RS14
- # LPD4_VDD2_1V1
- # CPU_DRAM_1V1
- # VDD_SOC_1V8
- (near R965) # I2C ADDR:  20h(0100000x)
- (near U909) 1 MHz I2C (Fm+)
- RS5-2
- (near R974) RS5-1
- 0.57V - 0.60V - 0.67V (LPDDR4X)
  1.06V - 1.10V - 1.17V (LPDDR4)
- RS1-1
- # PWR MEAS recovery to default statue once system reset, to
  prevent syetem boot fail caused by LdSW full scale settings;
- #I2C ADDR: 0b'0110100x
- RS10
- RS9
- Fixed Curr Sense RES
- RS7
- RS8
- SOM TEMP SENSOR
- SYS ID (RSV)
- FSC: Vsense(100mV)/RS
- RS11
- RS15
- RS12
- (near U913) OD
- 20mA
- 100mA
- 250mA
- 400mA
- 1A
- 4.99 OHM
- 1 OHM
- 0.4 OHM
- 0.25 OHM
- 0.1 OHM
- (near U913) #I2C ADDR: 0b'1001000x
- (near TP959) Power Measurement Equations:
- I_sense = Vsense / Rs
  Vout     = Vsense- = V(sense+) - Vsense
  Power = I_sense x Vout
- 8
- 7
- 6
- 5
- 4
- 3
- 2
- 1
- REVISION
- DESCRIPTION
- DATE
- APPROVED
- F
- E
- D
- C
- B
- PROJECT:
- REV.
- ENG:
- APPROVALS
- PROJECT
- JordanDSP LLC <https://www.jordandsp.com>
- Envision Excellence
- SHT.
- A
- DSN:
- CHK:
- REFERENCE ITEMS
- PRJ VCS REVISION:
- TITLE
- DOC VCS REVISION:
- MODIFIED DATE:
- BOM:
- FAB DWG:
- FIRMWARE:
- ASSY DWG:
- SCALE:
- SIZE
- CAGE CODE
- FILE NAME
- DWG NO.
- PAGE
- PRODUCT REV
- OF
- (in symbol TitleBlock_MCPG) Microcontroller Product Group; 6501 William Cannon Drive West / Austin, TX 78735-8598; This document contains information proprietary to NXP and shall not be used for engineering design,; procurement or manufacture in whole or in part without the express written permission of NXP Semiconductors.; ICAP Classification:; CP:; IUO:; PUBI:; Designer:; Drawing Title:; Drawn by:; Page Title:; Approved:; Size; Document Number; Rev; Date:; Sheet; of

### Library data of the parts
*#12 = TitleBlock_MCPG: OrgName: NXP Semiconductor; OrgAddr1: NO. 192 Liangjing Rd. Pudong New Area, ShangHai; Page Create Date: March  8, 1995; DrawnBy: NXP SE; FCP: ____; Page Modify Date: *
C901 C903 C909 C922 C928 C930 C938 C943 = CAP_NP: CAP CER 1.0UF 10V 10% X5R 0402; CLASS: DISCRETE; SIGNAL_MODEL: DEFAULT_CAPACITOR_1e+06pF_2_1; AGILE_PN: 150-75772; MFG_NAME01: YAGEO AMERICA; MFG_PN01: CC0402KRX5R6BB105; CAD_APPROVED: Yes; FPLIST: CC0402_25,CC0402_HD,0402_CC; PCB Footprint: 0402_CC; ROHS: Yes; HEIGHT: 0.6MM; TOL: 10%; voltage rating: 10V; Package Size: 0402
C902 C905 C907 C908 = CAP_NP: CAP CER 0.01uF 25V 5% X7R 0402; CLASS: DISCRETE; MFG_PN01: CC0402JRX7R8BB103; MFG_NAME01: YAGEO Corporation; Temp Range: -55¡ãC - 125¡ãC; CAD_APPROVED: Yes; FPLIST: CC0402_25,CC0402_HD,0402_CC,capc0402_l; AGILE_PN: 150-81047; ROHS: Yes; Tolerance: 5%; Package Type: Surface Mount, MLCC; HEIGHT: 0.55 MM; Package Size: 0402 (1005 Metric); PCB Footprint: CC0402_25
C904 C906 C916 C942 = CAP_NP: CAP CER 0.1UF 25V 10% X5R 0402; CLASS: DISCRETE; AGILE_PN: 150-78633; MFG_NAME01: YAGEO AMERICA; MFG_PN01: CC0402KRX5R8BB104; CAD_APPROVED: Yes; FPLIST: CC0402_25,CC0402_HD,0402_CC; PCB Footprint: 0402_CC; Tolerance: 10%; ROHS: Yes; HEIGHT: 0.55MM; Package Size: 0402
C910 C917 C920 C921 C924 C927 C932 C933 C936 C939-C941 C945 C948-C950 = CAP_NP: CAP CER 0.01uF 25V 5% X7R 0402; CLASS: DISCRETE; AGILE_PN: 150-81047; FPLIST: CC0402_25,CC0402_HD,0402_CC,capc0402_l; CAD_APPROVED: Yes; Temp Range: -55¡ãC - 125¡ãC; MFG_NAME01: YAGEO Corporation; MFG_PN01: CC0402JRX7R8BB103; Package Size: 0402 (1005 Metric); HEIGHT: 0.55 MM; Package Type: Surface Mount, MLCC; Tolerance: 5%; ROHS: Yes; PCB Footprint: CC0402_25
C911 C925 C934 C946 = CAP_NP: CAP CER 1.0UF 10V 10% X5R 0402; CLASS: DISCRETE; FPLIST: CC0402_25,CC0402_HD,0402_CC; CAD_APPROVED: Yes; MFG_PN01: CC0402KRX5R6BB105; MFG_NAME01: YAGEO AMERICA; AGILE_PN: 150-75772; SIGNAL_MODEL: DEFAULT_CAPACITOR_1e+06pF_2_1; Package Size: 0402; voltage rating: 10V; TOL: 10%; HEIGHT: 0.6MM; ROHS: Yes; PCB Footprint: 0402_CC
C912 C913 C923 C926 C929 C931 C935 C937 C947 = CAP_NP: CAP CER 0.1UF 25V 10% X5R 0402; CLASS: DISCRETE; FPLIST: CC0402_25,CC0402_HD,0402_CC; CAD_APPROVED: Yes; MFG_PN01: CC0402KRX5R8BB104; MFG_NAME01: YAGEO AMERICA; AGILE_PN: 150-78633; HEIGHT: 0.55MM; ROHS: Yes; Tolerance: 10%; Package Size: 0402; PCB Footprint: 0402_CC
C914 C915 = CAP_NP: CAP CER 4.7uF 10V 10% X5R 0402; CLASS: DISCRETE; AGILE_PN: 150-80044; MFG_NAME01: SAMSUNG ELECTRO MECHANICS; MFG_PN01: CL05A475KP5NRNC; CAD_APPROVED: Yes; FPLIST: cc0402_tol0p15,cc0402_tol0p15_ov,0402_cc_nsp; 3D_Mechanical_Footprint_File: cc0402_tol0p15; PCB Footprint: cc0402_tol0p15; Tolerance: 10%; ROHS: Yes; HEIGHT: 0.65MM
  C915: VOLTAGE: 10V
C918 = CAP_NP: CAP CER 1uF 16V 10% X5R 0402; CLASS: DISCRETE; MFG_PN01: CC0402KRX5R7BB105; MFG_NAME01: YAGEO; CAD_APPROVED: Yes; FPLIST: CC0402_25,CC0402_HD,0402_CC; AGILE_PN: 150-78973; PCB Footprint: 0402_CC; ROHS: Yes; Tolerance: 10%; HEIGHT: 0.55 MM
C919 = CAP_NP: CAP CER 0.22UF 10V 20% X5R 0201; CLASS: DISCRETE; FPLIST: CC0201,CC0201_HD,0201_CC; CAD_APPROVED: Yes; MFG_PN01: LMK063BJ224MP-F; MFG_NAME01: Taiyo Yuden; AGILE_PN: 150-78815; HEIGHT: 0.33MM; ROHS: Yes; Tolerance: 20%; PCB Footprint: 0201_CC
C944 = CAP_NP: CAP CER 0.22UF 10V 20% X5R 0201; CLASS: DISCRETE; AGILE_PN: 150-78815; MFG_NAME01: Taiyo Yuden; MFG_PN01: LMK063BJ224MP-F; CAD_APPROVED: Yes; FPLIST: CC0201,CC0201_HD,0201_CC,0201_CC_012SM_NSP; PCB Footprint: 0201_CC; Tolerance: 20%; ROHS: Yes; HEIGHT: 0.33MM
C951-C954 = CAP_NP: CAP CER 220PF 50V 5% C0G 0402; CLASS: DISCRETE; MFG_PN01: C0402C221J5GAC; MFG_NAME01: KEMET; Temp Range: -55C to +125C; CAD_APPROVED: Yes; FPLIST: CC0402_25,CC0402_HD,0402_CC,capc0402_l; AGILE_PN: 150-30297; ROHS: Yes; Tolerance: 5%; HEIGHT: 0.55MM; Package Size: 0402; PCB Footprint: 0402_CC
D901 D903 D904 = DIODE_SCHTKY: DIODE SCH SW 1A 20V AEC-Q101 SOD323; CLASS: IC; MFG_PN01: PMEG2010EJ,115; MFG_NAME01: NEXPERIA; Temp Range: -65¡ãC to 150¡ãC; CAD_APPROVED: Yes; AGILE_PN: 480-80156; PCB Footprint: sod323; VOLTAGE: 20V; Rated Voltage: 20V; HEIGHT: 0.8MM
D902 = DIODE_SCHTKY: DIODE SCH SW 1A 20V AEC-Q101 SOD323; CLASS: IC; AGILE_PN: 480-80156; CAD_APPROVED: Yes; Temp Range: -65¡ãC to 150¡ãC; MFG_NAME01: NEXPERIA; MFG_PN01: PMEG2010EJ,115; HEIGHT: 0.8MM; Rated Voltage: 20V; VOLTAGE: 20V; PCB Footprint: sod323
J901 = CONN_HDR_6X2_A: CON 2X6 PLUG SHRD SMT 0.4MM SP 51H AU; CLASS: IO; 3D_Mechanical_Footprint_File: ftp://fcl.am.freescale.net/ALLEGRO/step/con12_0p4_4p12x2p05_sm.step; MFG_NAME01: Hirose Connector; Contact Voltage: 30 V; AGILE_PN: 211-81502; PCB Footprint: con12_0p4_4p12x2p05_sm; Package Type: Solder
Q901 = NX3008NBKW_SOT323: TRAN NMOS SW 30V 350mA AEC-Q101 SC-70; CLASS: IC; AGILE_PN: 480-79736; MFG_NAME01: NEXPERIA; CAD_APPROVED: Yes; MFG_PN01: NX3008NBKW,115; ROHS: Yes; HEIGHT: 1.1MM; PCB Footprint: sc70_3
R901 = RES: RES MF 0.4 OHM 1/10W 1% AEC-Q200 0603; CLASS: DISCRETE; AGILE_PN: 470-81316; FPLIST: RC0603_OV,RC0603,R603-X2,0603_CC; CAD_APPROVED: Yes; Temp Range: -55¡ãC to +155¡ãC; MFG_NAME01: YAGEO; MFG_PN01: RL0603FR-070R4L; PCB Footprint: RC0603_OV; HEIGHT: 0/55MM; ROHS: Yes
R902 R903 R905 R909 R916-R918 R961 R969 R970 R972 R1015 R1018 R1032-R1035 R1042 R1044 = RES: RES MF ZERO OHM 1/16W 5% 0402; CLASS: DISCRETE; AGILE_PN: 470-75394; MFG_NAME01: YAGEO AMERICA; MFG_PN01: RC0402JR-070RL; CAD_APPROVED: Yes; FPLIST: RC0402_25,RC0402_HD,RC0402_X2,0402_CC; VOLTAGE: 1/16W; Tolerance: 5%; ROHS: Yes; HEIGHT: 0.45 MM; PCB Footprint: 0402_CC
R904 R1040 R1041 = RES: RES MF 0.02OHM 1/4W 0.5% 0805; CLASS: DISCRETE; MFG_PN01: WSL0805R0200DEA18; MFG_NAME01: VISHAY INTERTECHNOLOGY; CAD_APPROVED: Yes; FPLIST: RC0805_OV,RC0805,0805_CC; AGILE_PN: 470-79241; PCB Footprint: RC0805_OV; ROHS: Yes; HEIGHT: 0.46MM
R906 R910 = RES: RES MF ZERO OHM 1/20W -- 0201; CLASS: DISCRETE; FPLIST: RC0201,0201_CC,RC0201_X2; CAD_APPROVED: Yes; MFG_PN01: CR0201-J/-000GLF; MFG_NAME01: BOURNS; AGILE_PN: 470-76631; PCB Footprint: 0201_CC; HEIGHT: 0.30 MM; ROHS: Yes
R907 R933 R934 R936 R955 R956 R959 R971 R993-R995 R1012 R1024 R1025 R1027 = RES: RES MF 10K 1/16W 5% 0402; CLASS: DISCRETE; FPLIST: RC0402_25,RC0402_HD,0402_CC; CAD_APPROVED: Yes; MFG_PN01: CRCW040210K0JNED; MFG_NAME01: VISHAY INTERTECHNOLOGY; AGILE_PN: 470-75557; PCB Footprint: 0402_CC; ROHS: Yes; Tolerance: 5%; HEIGHT: 0.4 MM
R908 = RES: RES MF 1.0K 1/10W 5% 0603; CLASS: DISCRETE; MFG_PN01: CR0603-10W-102JT; MFG_NAME01: VENKEL COMPANY; CAD_APPROVED: YES; FPLIST: RC0603_OV,RC0603,0603_CC; AGILE_PN: 470-75412; ROHS: Yes; Tolerance: 5%; HEIGHT: 0.6MM; PCB Footprint: RC0603_OV
R911 R921 R923 R924 R927 R929 R935 R937 R939 R941 R943 R945 R947 R949 R957 R958 R960 R962-R968 R983 R984 R987 R989 R991 R996 R997 R1000 R1005 R1006 R1008 R1016 R1020 R1022 R1026 R1028 R1029 R1043 R1045 = RES: RES MF ZERO OHM 1/16W 5% 0402; CLASS: DISCRETE; FPLIST: RC0402_25,RC0402_HD,RC0402_X2,0402_CC; CAD_APPROVED: Yes; MFG_PN01: RC0402JR-070RL; MFG_NAME01: YAGEO AMERICA; AGILE_PN: 470-75394; HEIGHT: 0.45 MM; ROHS: Yes; Tolerance: 5%; VOLTAGE: 1/16W; PCB Footprint: 0402_CC
R912 = RES: RES MF 499 OHM 1/16W 1% 0402; CLASS: DISCRETE; AGILE_PN: 470-30807; FPLIST: RC0402_25,RC0402_HD,0402_CC; CAD_APPROVED: Yes; MFG_NAME01: ROHM; MFG_PN01: MCR01MZPF4990; PCB Footprint: RC0402_25; HEIGHT: 0.40 MM; ROHS: Yes
R913-R915 R922 R938 R951-R953 R985 R1011 R1013 = RES: RES MF 10K 1/16W 5% 0402; CLASS: DISCRETE; AGILE_PN: 470-75557; MFG_NAME01: VISHAY INTERTECHNOLOGY; MFG_PN01: CRCW040210K0JNED; CAD_APPROVED: Yes; FPLIST: RC0402_25,RC0402_HD,0402_CC; PCB Footprint: 0402_CC; HEIGHT: 0.4 MM; Tolerance: 5%; ROHS: Yes
R919 = RES: RES MF 499 OHM 1/10W 0.1% AEC-Q200 0603; CLASS: DISCRETE; AGILE_PN: 470-82950; FPLIST: RC0603_OV,RC0603,0603_CC; CAD_APPROVED: Yes; Temp Range: -55¡ãC ~ 155¡ãC; MFG_NAME01: KOA Speer; MFG_PN01: RN73R1JTTD4990B25; 3D_Mechanical_Footprint_File: ftp://fcl.am.freescale.net/ALLEGRO/step/rc0603_ov.STEP; PCB Footprint: RC0603_OV; HEIGHT: 0.55 MM; Package Type: PCB Mount; ROHS: Yes
R920 = RES: RES MF 10 OHM 1/16W 0.1% 0603; CLASS: DISCRETE; MFG_PN01: CPF0603B10RE1; MFG_NAME01: TE CONNECTIVITY LTD; Temp Range: -55C to +155C; CAD_APPROVED: Yes; FPLIST: RC0603_OV,RC0603,0603_CC; AGILE_PN: 470-82209; PCB Footprint: RC0603_OV; ROHS: Yes; HEIGHT: 0.55MM
R926 R928 R946 R948 R988 R990 R1019 R1021 = RES: RES MF ZERO OHM 1/20W -- 0201; CLASS: DISCRETE; AGILE_PN: 470-76631; MFG_NAME01: BOURNS; MFG_PN01: CR0201-J/-000GLF; CAD_APPROVED: Yes; FPLIST: RC0201,0201_CC,RC0201_X2; PCB Footprint: 0201_CC; ROHS: Yes; HEIGHT: 0.30 MM
R930 = RES: RES TF 806 OHM 1% 1/10W AEC-Q200 0402; CLASS: DISCRETE; MFG_PN01: ERJ-2RKF8060X; MFG_NAME01: PANASONIC; CAD_APPROVED: Yes; FPLIST: RC0402_25,RC0402_HD,0402_CC; AGILE_PN: 470-81001; PCB Footprint: RC0402_25; ROHS: Yes; HEIGHT: 0.4MM
R931 = RES: RES MF 1.00 OHM 1/10W 1% 0603; CLASS: DISCRETE; AGILE_PN: 470-30469; FPLIST: RC0603_OV,RC0603,0603_CC; CAD_APPROVED: Yes; MFG_NAME01: YAGEO AMERICA; MFG_PN01: RC0603FR-071RL; PCB Footprint: RC0603_OV; HEIGHT: 0.55 MM; ROHS: Yes
R932 = RES: RES MF 0.02OHM 1/4W 0.5% 0805; CLASS: DISCRETE; AGILE_PN: 470-79241; FPLIST: RC0805_OV,RC0805,0805_CC; CAD_APPROVED: Yes; MFG_NAME01: VISHAY INTERTECHNOLOGY; MFG_PN01: WSL0805R0200DEA18; PCB Footprint: RC0805_OV; HEIGHT: 0.46MM; ROHS: Yes
R942 R973 = RES: RES MF 2.0 OHM 1/8W 1% AEC-Q200 0603; CLASS: DISCRETE; AGILE_PN: 470-81851; FPLIST: RC0603_OV,RC0603,0603_CC; CAD_APPROVED: Yes; Temp Range: -55¡ãC to +155¡ãC; MFG_NAME01: KOA SPEER; MFG_PN01: RK73H1JTTD2R00F; PCB Footprint: RC0603_OV; HEIGHT: 0.55MM; ROHS: Yes
R944 R974 = RES: RES MF 0.05OHM 1/4W 1% 0805; CLASS: DISCRETE; MFG_PN01: WSL0805R0500FEA18; MFG_NAME01: VISHAY INTERTECHNOLOGY; CAD_APPROVED: Yes; FPLIST: RC0805_OV,RC0805,0805_CC; AGILE_PN: 470-79239; PCB Footprint: RC0805_OV; ROHS: Yes; HEIGHT: 0.46MM
R950 = RES: RES MF 1.27K  1/10W 1% AEC-Q200 0402; CLASS: DISCRETE; AGILE_PN: 470-30846; FPLIST: RC0402_25,RC0402_HD,0402_CC; CAD_APPROVED: Yes; VOLTAGE: 50V; Temp Range: -55¡ãC to +155¡ãC; MFG_NAME01: KOA SPEER; MFG_PN01: RK73H1ETTP1271F; PCB Footprint: RC0402_25; HEIGHT: 0.40 MM; ROHS: Yes
R975-R982 R1036 R1037 = RES: RES MF 4.7K 1/10W 5% AEC-Q200 0402; CLASS: DISCRETE; AGILE_PN: 470-82064; FPLIST: RC0402_25,RC0402_HD,0402_CC,RC0402_X2; CAD_APPROVED: Yes; VOLTAGE: 50V; Temp Range: -55C to +155C; MFG_NAME01: KOA SPEER; MFG_PN01: RK73B1ETTP472J; HEIGHT: 0.41mm; Tolerance: 5%; ROHS: Yes; PCB Footprint: 0402_CC
R992 = RES: RES MF 2.05K  1/10W 1% AEC-Q200 0402; CLASS: DISCRETE; AGILE_PN: 470-30868; FPLIST: RC0402_25,RC0402_HD,0402_CC; CAD_APPROVED: Yes; VOLTAGE: 50V; Temp Range: -55C to +155C; MFG_NAME01: KOA SPEER; MFG_PN01: RK73H1ETTP2051F; PCB Footprint: RC0402_25; HEIGHT: 0.40 MM; ROHS: Yes
R998 = RES: RES MF 1.00 OHM 1/10W 1% 0603; CLASS: DISCRETE; MFG_PN01: RC0603FR-071RL; MFG_NAME01: YAGEO AMERICA; CAD_APPROVED: Yes; FPLIST: RC0603_OV,RC0603,0603_CC; AGILE_PN: 470-30469; PCB Footprint: RC0603_OV; ROHS: Yes; HEIGHT: 0.55 MM
R999 = RES: RES MF 0.4 OHM 1/10W 1% AEC-Q200 0603; CLASS: DISCRETE; MFG_PN01: RL0603FR-070R4L; MFG_NAME01: YAGEO; Temp Range: -55¡ãC to +155¡ãC; CAD_APPROVED: Yes; FPLIST: RC0603_OV,RC0603,R603-X2,0603_CC; AGILE_PN: 470-81316; PCB Footprint: RC0603_OV; ROHS: Yes; HEIGHT: 0/55MM
R1001 R1007 = RES: RES 0.25 OHM 1% 1/8W 0805; CLASS: DISCRETE; MFG_PN01: RL0805FR-070R25L; MFG_NAME01: Yageo; Temp Range: -55 ¡ãC to +125 ¡ãC; CAD_APPROVED: Yes; FPLIST: RC0805_OV,RC0805,0805_CC; AGILE_PN: 470-82521; PCB Footprint: RC0805_OV; ROHS: Yes; HEIGHT: 0.6MM; Package Size: 0805 (2012 Metric)
R1002 = RES: RES MF 4.99 OHM 0.1% 1/16W 0603; CLASS: DISCRETE; AGILE_PN: 470-82515; FPLIST: RC0603_OV,RC0603,0603_CC; CAD_APPROVED: Yes; Temp Range: -55¡ãC ~ 155¡ãC; MFG_NAME01: TE CONNECTIVITY LTD; MFG_PN01: CPF0603B4R99E1; PCB Footprint: RC0603_OV; Package Size: 0603 (1608 Metric); HEIGHT: 0.55MM; ROHS: Yes
R1003 R1004 R1017 R1031 = RES: RES MF 0.1 OHM 1/4W 1% AEC-Q200 0805; CLASS: DISCRETE; MFG_PN01: WSL0805R1000FEA18; MFG_NAME01: VISHAY INTERTECHNOLOGY; Temp Range: -65¡ã C to +170¡ã C; CAD_APPROVED: Yes; FPLIST: RC0805_OV,RC0805,0805_CC; AGILE_PN: 470-82403; PCB Footprint: RC0805_OV; ROHS: Yes; HEIGHT: 0.584MM
R1009 = RES: RES MF 100K 1/16W 5% 0402; CLASS: DISCRETE; Temp Range: -55C to +155C; VOLTAGE: 50V; AGILE_PN: 470-75597; MFG_NAME01: VENKEL COMPANY; MFG_PN01: CR0402-16W-104JT; CAD_APPROVED: Yes; FPLIST: RC0402_25,RC0402_HD,0402_CC; PCB Footprint: 0402_CC; Tolerance: 5%; ROHS: Yes; HEIGHT: 0.40 MM
R1010 = RES: RES MF 2.2K 1/16W 5% 0402; CLASS: DISCRETE; AGILE_PN: 470-75636; FPLIST: RC0402_25,RC0402_HD,0402_CC; CAD_APPROVED: Yes; MFG_NAME01: BOURNS; MFG_PN01: CR0402-JW-222GLF; PCB Footprint: RC0402_25; HEIGHT: 0.4 MM; Tolerance: 5%; ROHS: Yes
R1014 = RES: RES 0.25 OHM 1% 1/8W 0805; CLASS: DISCRETE; AGILE_PN: 470-82521; FPLIST: RC0805_OV,RC0805,0805_CC; CAD_APPROVED: Yes; Temp Range: -55 ¡ãC to +125 ¡ãC; MFG_NAME01: Yageo; MFG_PN01: RL0805FR-070R25L; PCB Footprint: RC0805_OV; Package Size: 0805 (2012 Metric); HEIGHT: 0.6MM; ROHS: Yes
R1023 = RES: RES MF 3.24K 1/16W 1% 0402; CLASS: DISCRETE; AGILE_PN: 470-76185; FPLIST: RC0402_25,RC0402_HD,0402_CC; CAD_APPROVED: Yes; Temp Range: -55¡ãC to +175¡ãC; MFG_NAME01: SMEC; MFG_PN01: RC73A2Z3241FTF; PCB Footprint: RC0402_25; HEIGHT: 0.45MM; ROHS: Yes
TP901-TP903 TP906 TP907 TP919-TP933 TP943 TP945-TP947 TP949 TP951 TP955 TP958 TP960 = T POINT R: TEST POINT PAD .035 SMT, no part to order; CLASS: IC; AGILE_PN: 510-75618; CAD_APPROVED: Yes; PCB Footprint: testpoint_35mil; HEIGHT: 0.1MM; ROHS: Yes
TP904 TP905 TP908-TP911 TP917 TP918 TP934-TP942 TP944 TP948 TP950 TP952-TP954 TP956 TP957 TP959 TP961-TP965 = T POINT R: TEST POINT PAD .035 SMT, no part to order; CLASS: IC; CAD_APPROVED: Yes; AGILE_PN: 510-75618; PCB Footprint: testpoint_35mil; ROHS: Yes; HEIGHT: 0.1MM
U901 = DML3006LFDS-7_A_0: IC LOAD SW 0.5-13.5V 10.5A 3-5.5V DFN2020-8; 3D_Mechanical_Footprint_File: ftp://fcl.am.freescale.net/ALLEGRO/step/dfn2020_0p5_sq2.STEP; MFG_NAME01: DIODES INC; Temp Range: -40¡ãC to +85¡ãC; CAD_APPROVED: Yes; AGILE_PN: 315-83392; CLASS: IC; MFG_PN01: DML3006LFDS-7; VOLTAGE: 3-5.5V; ROHS: Yes; Supply Voltage: 3-5.5V; HEIGHT: 0.9MM; Package Size: 8-VFDFN Exposed Pad; PCB Footprint: dfn2020_0p5_sq2
U902 U904 U907 U911 U912 = PAC1934_UQFN16_A: IC MULTI CHANNEL POWER/ENERGY MONITOR  2.7-5.5V UQFN16; 3D_Mechanical_Footprint_File: ftp://fcl.am.freescale.net/ALLEGRO/step/qfn16_0p65_4X4_a.step; MFG_NAME01: MICROCHIP TECHNOLOGY INC; AGILE_PN: 312-82072; CLASS: IC; PCB Footprint: qfn16_0p65_4X4_a; MFG_PN01: PAC1934T-I/JQ
U903 U906 U908 U910 = TPS22990NDMLT_WSON10_2: IC LOAD SWITCH 10A 2.5-5.5V WSON10; 3D_Mechanical_Footprint_File: ftp://fcl.am.freescale.net/ALLEGRO/step/wson10_0p5_2p1x3p1.STEP; MFG_NAME01: TEXAS INSTRUMENTS; Temp Range: -40¡ãC ~ 105¡ãC; CAD_APPROVED: Yes; AGILE_PN: 315-82218; CLASS: IC; MFG_PN01: TPS22990NDMLT; VOLTAGE: 2.5-5.5V; ROHS: Yes; HEIGHT: 0.8MM; PCB Footprint: wson10_0p5_2p1x3p1
U905 = RT9193-33PB: IC VREG LDO 3.3V 300MA SOT-23-5; AGILE_PN: 315-76265; CAD_APPROVED: Yes; MFG_NAME01: RICHTEK; CLASS: IC; PCB Footprint: sot23-5; HEIGHT: 1.295MM; ROHS: Yes; MFG_PN01: RT9193-33PB; 3D_Mechanical_Footprint_File: sot23-5
U909 = ADP5585ACPZ_LFCSP16_A: IC I/O EXPANDER I2C 1.65-3.6V LFCSP16; AGILE_PN: 312-83328; Supply Voltage: 1.8 V to 3 V; CAD_APPROVED: Yes; Temp Range: -40¡ã C to + 85¡ãC; MFG_NAME01: Analog Devices; CLASS: IC; Package Size: LFCSP-16; HEIGHT: 0.8MM; ROHS: Yes; MFG_PN01: ADP5585ACPZ-00-R7; PCB Footprint: lfcsp_16_0p5_3x3_a
U913 = PCT2075 _SON8_EP: IC I2C DIGITAL TEMP SENSOR AND THERMAL WDG 2.7-5.5V HWSON8; 3D_Mechanical_Footprint_File: ftp://fcl.am.freescale.net/ALLEGRO/step/hwson8_0p5_3p1x2p1.STEP; MFG_PN01: PCT2075TP,147; MFG_NAME01: NXP SEMICONDUCTORS; CAD_APPROVED: Yes; AGILE_PN: 312-81267; CLASS: IC; PCB Footprint: hwson8_0p5_3p1x2p1; VOLTAGE: 2.7-5.5V; ROHS: Yes; HEIGHT: 0.8 MM
U914 = 93AA56BT_SOT23-6: IC MEM EEPROM SERIAL 2K 16BIT 2.5-5.5V SOT23-6; MFG_PN01: 93LC56BT-I/OT; MFG_NAME01: MICROCHIP TECHNOLOGY INC; Temp Range: -40C to +85C; CAD_APPROVED: Yes; AGILE_PN: 334-77717; CLASS: IC; VOLTAGE: 2.5-5.5V; ROHS: Yes; HEIGHT: 1.45MM; PCB Footprint: sot23-6

## Sheet X-13 NOTE.SchDoc
size 513 x 386 mm; Address1: 350W 9th Ave; Address2: Suite 206; Address3: Escondido CA 92025; Address4: United States; Revision: -; ENG_APP_DATE: --/--/--; DSN_APP_DATE: --/--/--; CHK_APP_DATE: --/--/--
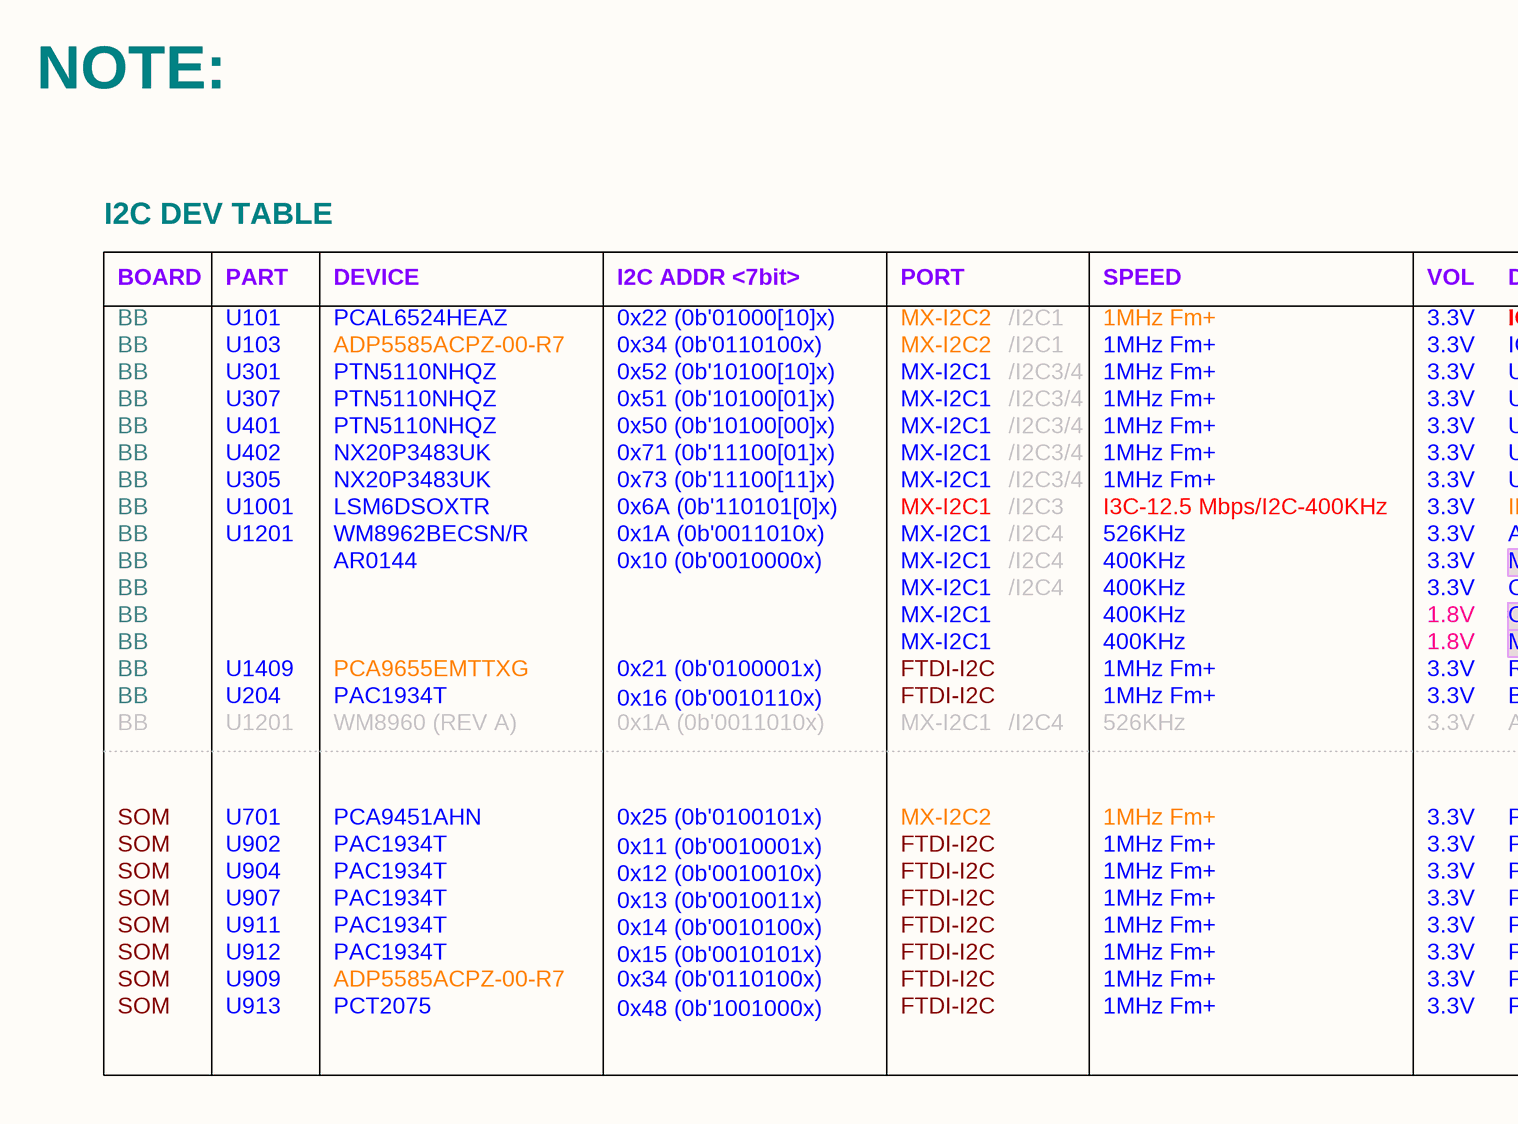
[diagram p28: X-13 NOTE.SchDoc, left]
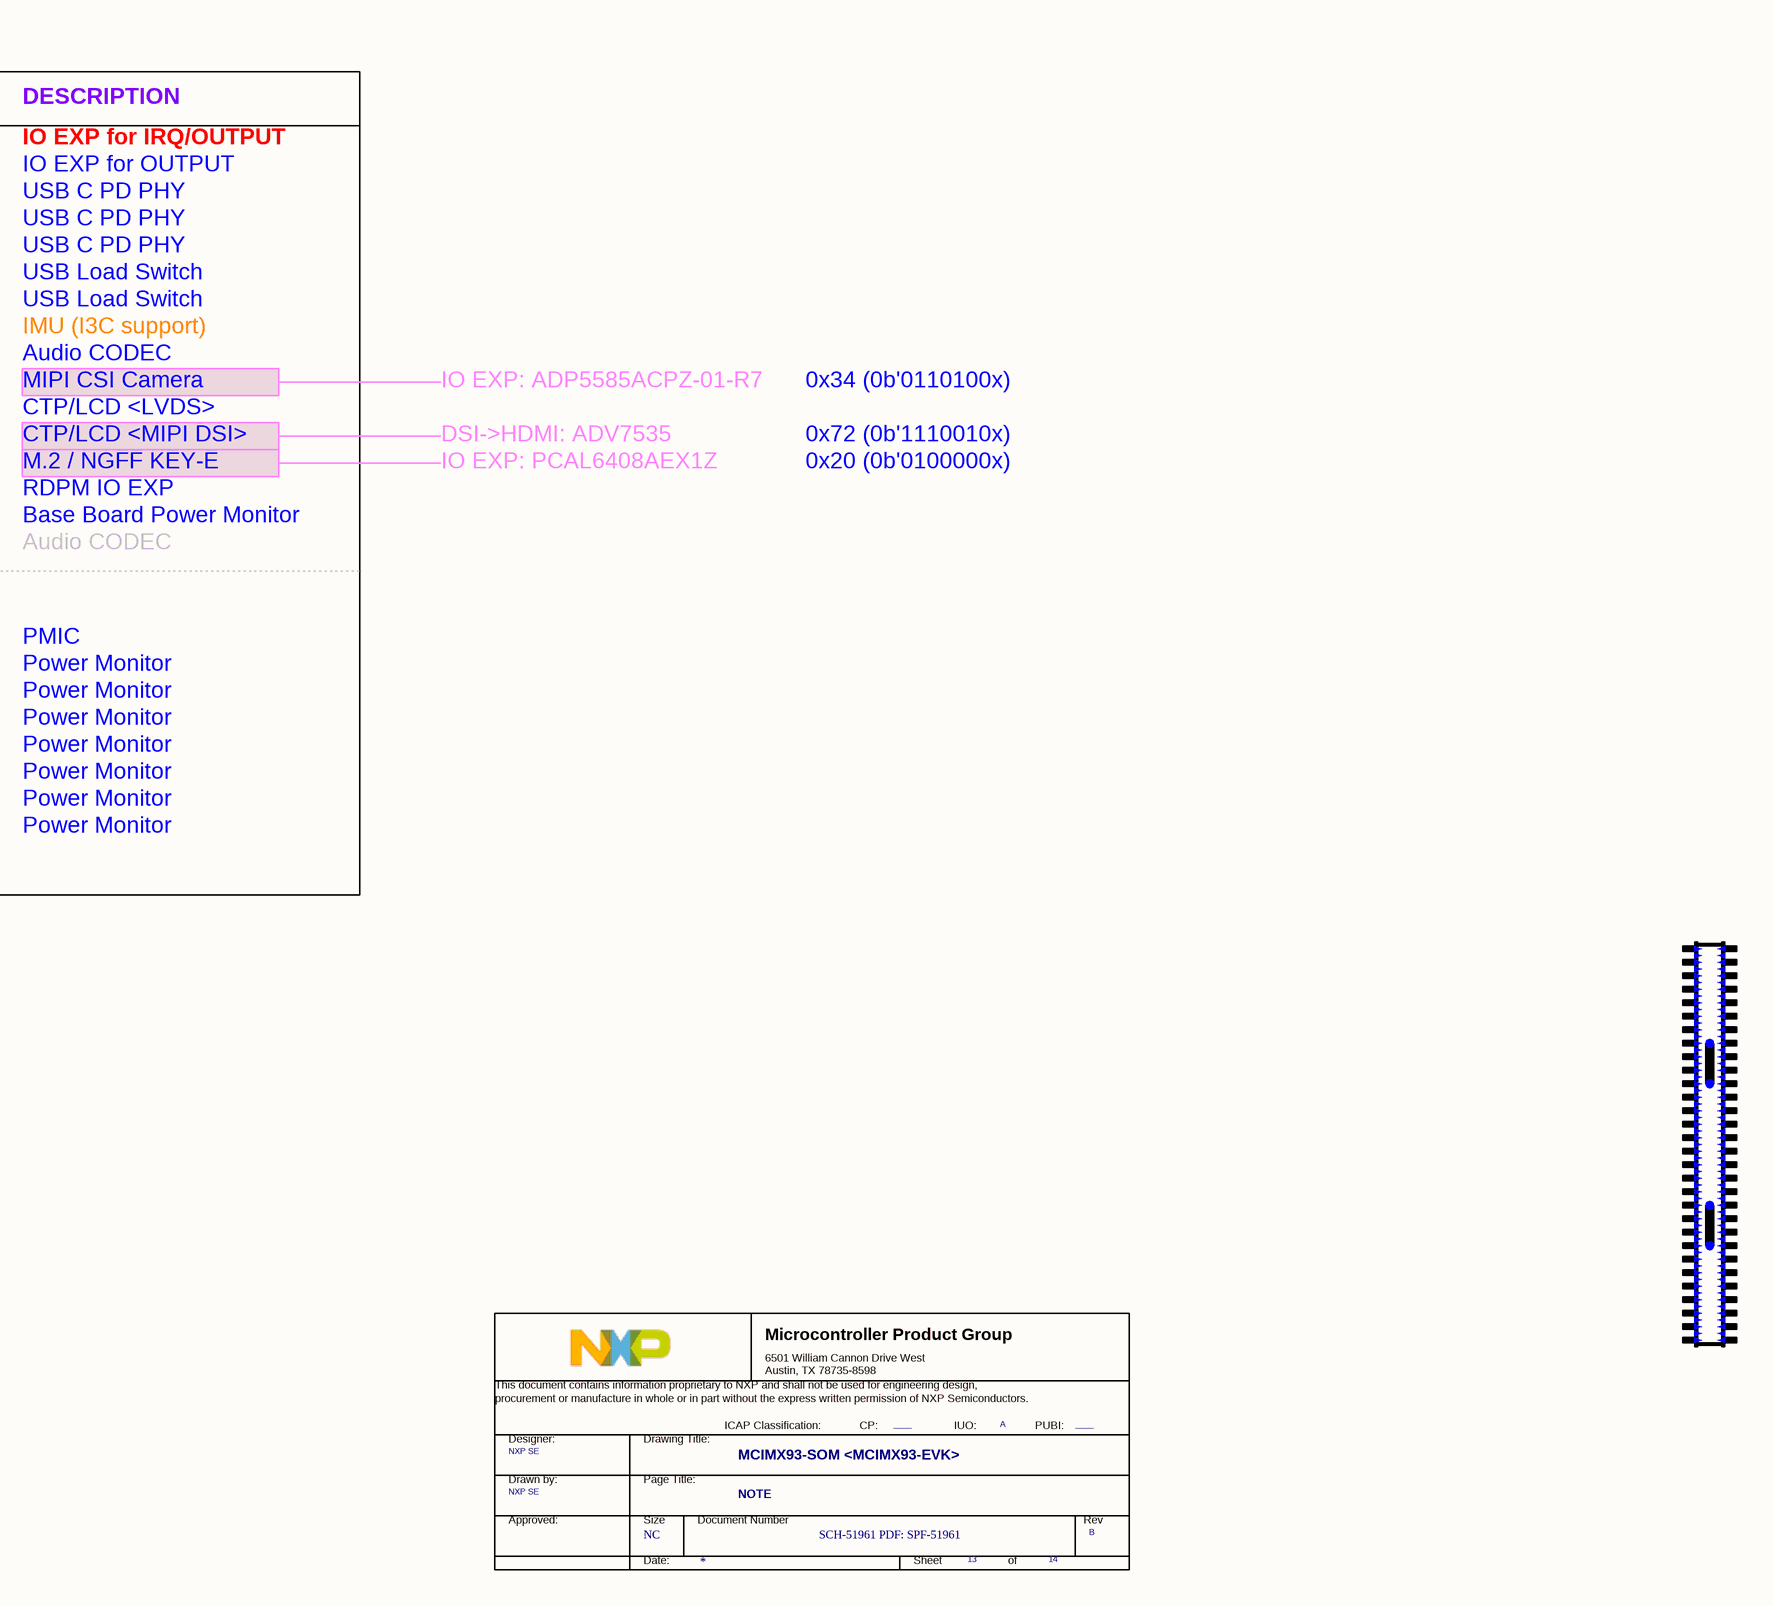
[diagram p29: X-13 NOTE.SchDoc, right]

### Parts
(Parts that share a designator on the sheet are numbered #1, #2 ... from top to bottom, then left to right.)
*#13  Doc: SCH-51961 PDF: SPF-51961  RevCode: B  Title: MCIMX93-SOM <MCIMX93-EVK>  Page Size: NC  Page Number: 13  Page Count: 14  PageTitle: NOTE  Designer: NXP SE  PUBI: ____  FIUO: A  (hidden comment: TitleBlock_MCPG)  (graphical)

### Notes on the sheet
- NOTE:
- I2C DEV TABLE
- BOARD
- PART
- DEVICE
- I2C ADDR <7bit>
- PORT
- SPEED
- VOL
- DESCRIPTION
- BB
- U103
- U101
- ADP5585ACPZ-00-R7
- PCAL6524HEAZ
- 0x22 (0b'01000[10]x)
- 0x34 (0b'0110100x)
- MX-I2C2
- /I2C1
- 1MHz Fm+
- 3.3V
- IO EXP for OUTPUT
- IO EXP for IRQ/OUTPUT
- U307
- U301
- U401
- PTN5110NHQZ
- 0x52 (0b'10100[10]x)
- 0x50 (0b'10100[00]x)
- 0x51 (0b'10100[01]x)
- MX-I2C1
- /I2C3/4
- USB C PD PHY
- U402
- U305
- NX20P3483UK
- 0x73 (0b'11100[11]x)
- 0x71 (0b'11100[01]x)
- USB Load Switch
- U1001
- U1201
- WM8962BECSN/R
- LSM6DSOXTR
- AR0144
- 0x10 (0b'0010000x)
- 0x6A (0b'110101[0]x)
- 0x1A (0b'0011010x)
- /I2C4
- /I2C3
- 400KHz
- I3C-12.5 Mbps/I2C-400KHz
- 526KHz
- IMU (I3C support)
- MIPI CSI Camera
- Audio CODEC
- IO EXP: ADP5585ACPZ-01-R7
- 1.8V
- CTP/LCD <MIPI DSI>
- CTP/LCD <LVDS>
- DSI->HDMI: ADV7535
- 0x72 (0b'1110010x)
- U204
- U1409
- PAC1934T
- PCA9655EMTTXG
- 0x16 (0b'0010110x)
- 0x21 (0b'0100001x)
- FTDI-I2C
- Base Board Power Monitor
- RDPM IO EXP
- M.2 / NGFF KEY-E
- IO EXP: PCAL6408AEX1Z
- 0x20 (0b'0100000x)
- WM8960 (REV A)
- SOM
- U701
- PCA9451AHN
- 0x25 (0b'0100101x)
- PMIC
- U902
- U904
- U907
- 0x11 (0b'0010001x)
- 0x13 (0b'0010011x)
- 0x12 (0b'0010010x)
- Power Monitor
- U911
- U912
- 0x15 (0b'0010101x)
- 0x14 (0b'0010100x)
- U909
- U913
- PCT2075
- 0x48 (0b'1001000x)
- 8
- 7
- 6
- 5
- 4
- 3
- 2
- 1
- REVISION
- DATE
- APPROVED
- F
- E
- D
- C
- B
- PROJECT:
- REV.
- ENG:
- APPROVALS
- PROJECT
- JordanDSP LLC <https://www.jordandsp.com>
- Envision Excellence
- SHT.
- A
- DSN:
- CHK:
- REFERENCE ITEMS
- PRJ VCS REVISION:
- TITLE
- DOC VCS REVISION:
- MODIFIED DATE:
- BOM:
- FAB DWG:
- FIRMWARE:
- ASSY DWG:
- SCALE:
- SIZE
- CAGE CODE
- FILE NAME
- DWG NO.
- PAGE
- PRODUCT REV
- OF
- (in symbol TitleBlock_MCPG) Microcontroller Product Group; 6501 William Cannon Drive West / Austin, TX 78735-8598; This document contains information proprietary to NXP and shall not be used for engineering design,; procurement or manufacture in whole or in part without the express written permission of NXP Semiconductors.; ICAP Classification:; CP:; IUO:; PUBI:; Designer:; Drawing Title:; Drawn by:; Page Title:; Approved:; Size; Document Number; Rev; Date:; Sheet; of

### Library data of the parts
*#13 = TitleBlock_MCPG: as *#12 on sheet C-12 PWR MEAS; Page Create Date: March  8, 1995; DrawnBy: NXP SE; FCP: ____; Page Modify Date: *